# Altium project Shuttler_AMC.PrjPcb (part 19 of 20)
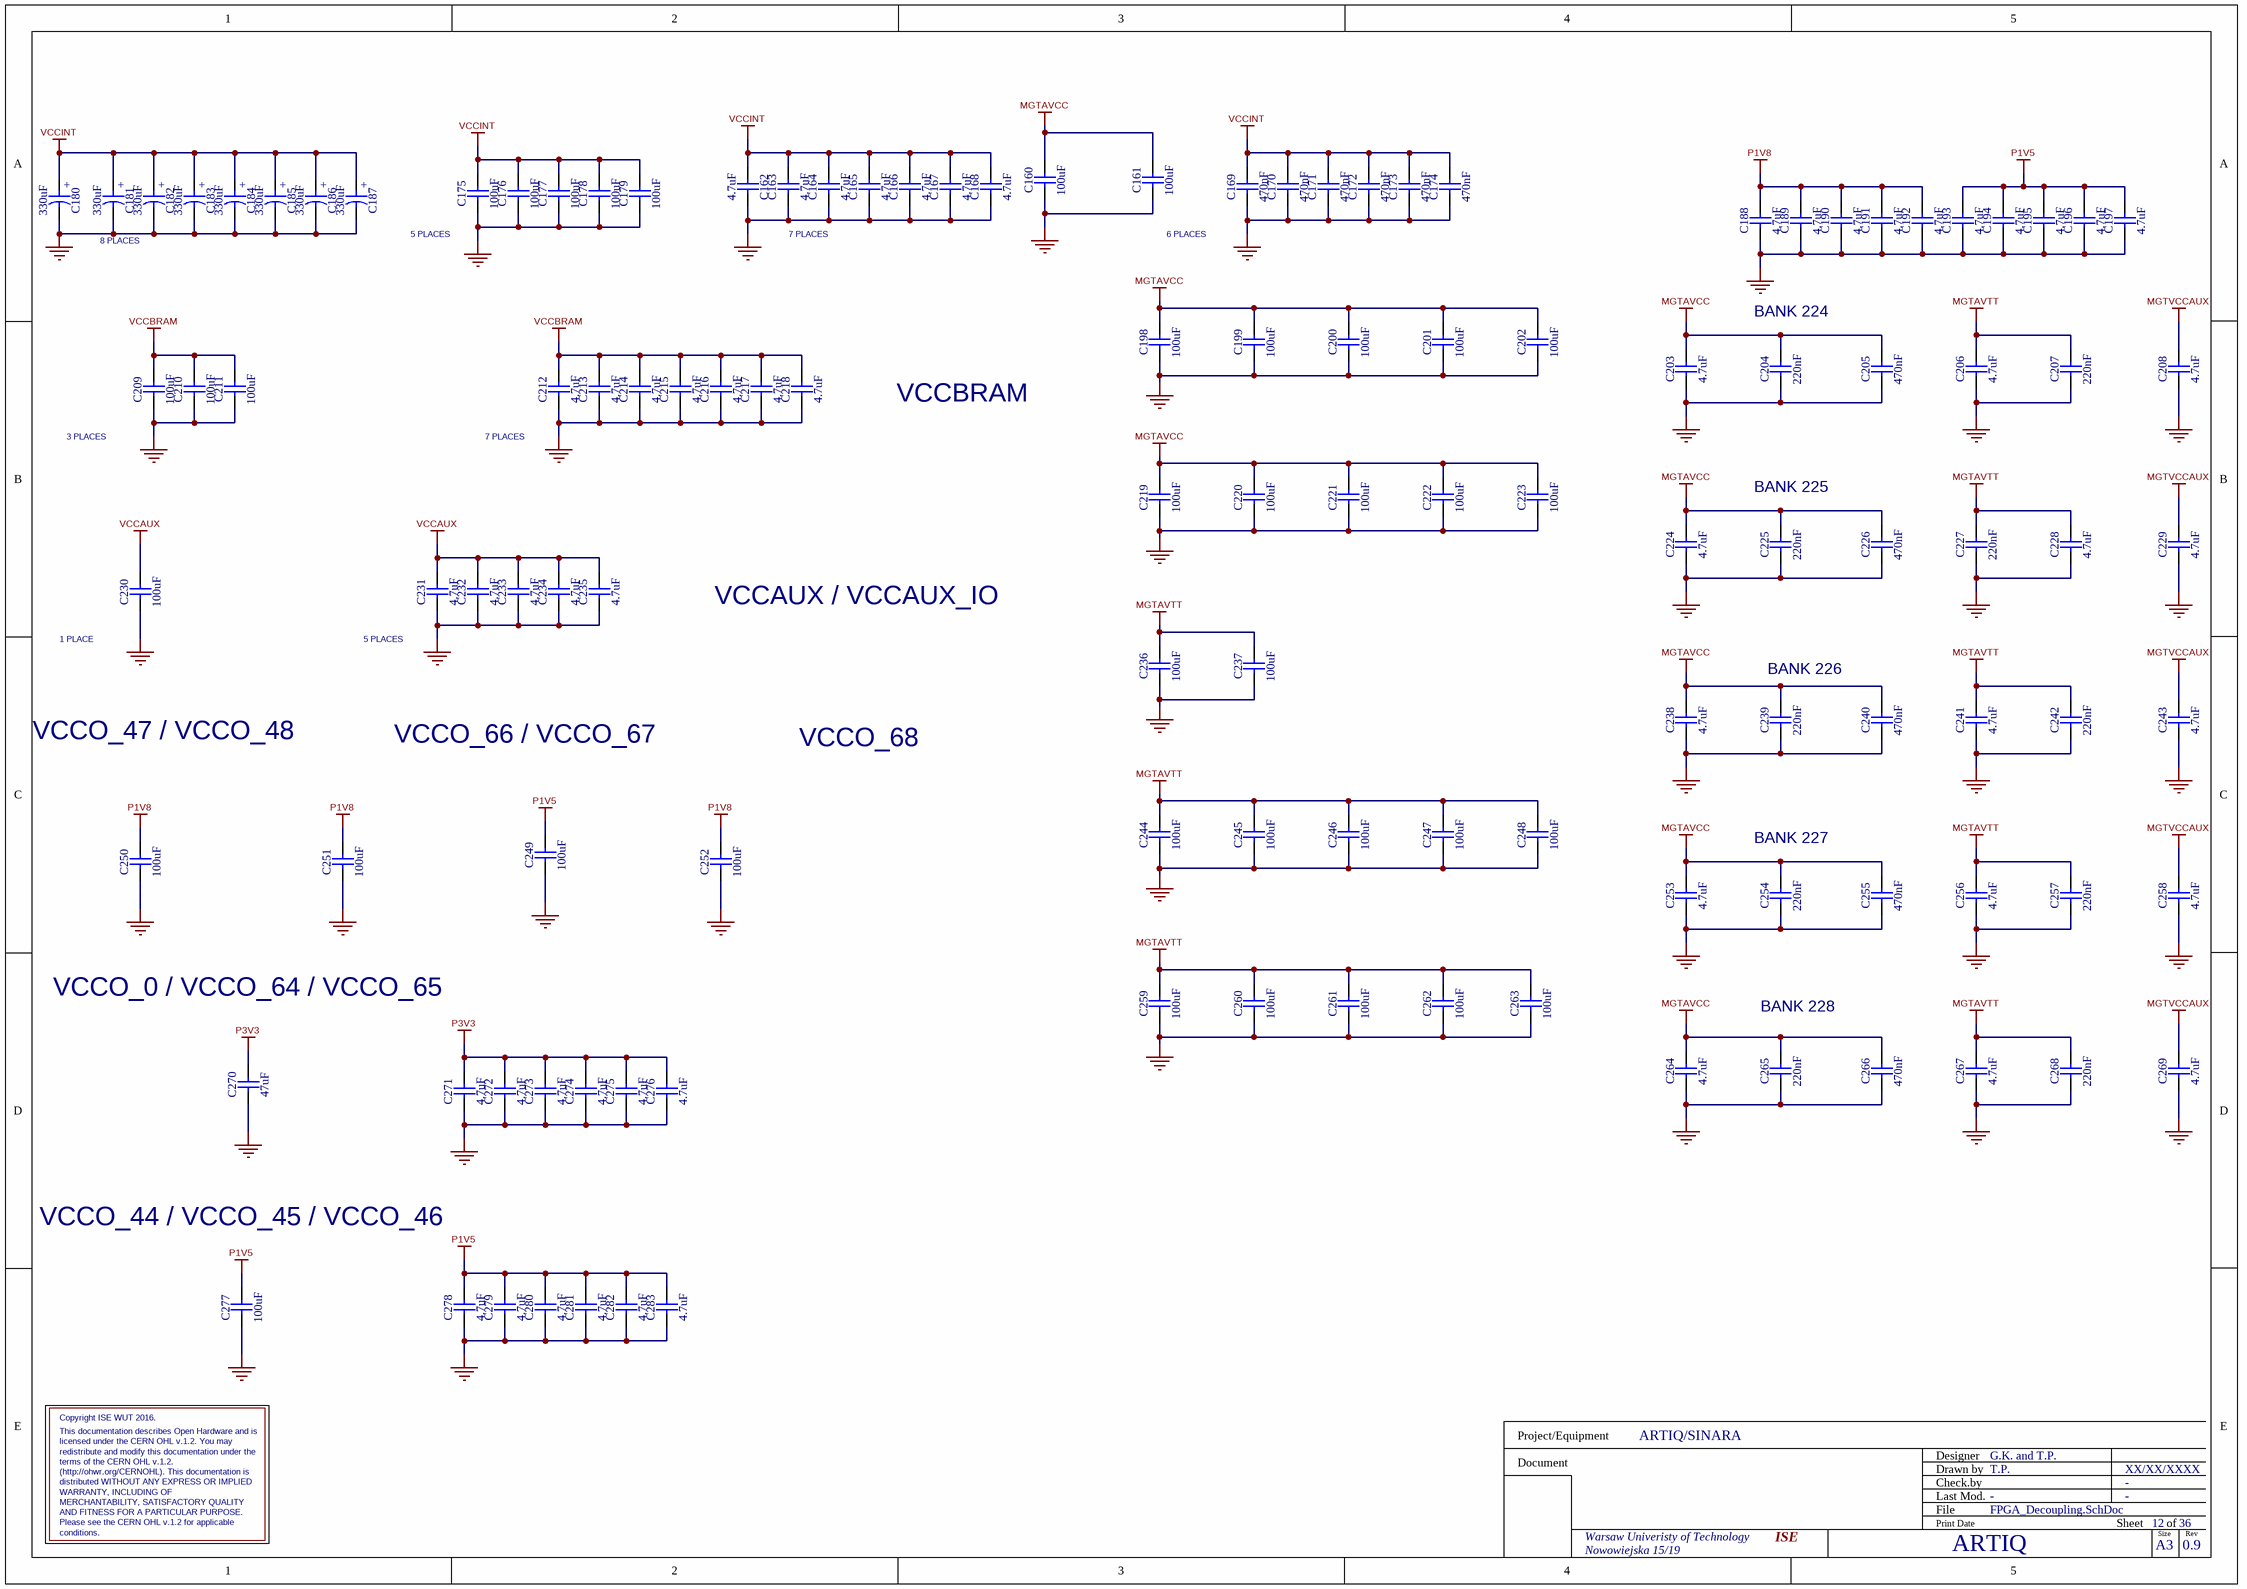
[diagram p37: FPGA_Decoupling.SchDoc]
## Nets that join several sheets
AVDD1V8: DACs/U_DAC_LTC2000 (5 pins), DACs/U_DAC_LTC2000 (5 pins), DACs/U_DAC_LTC2000 (5 pins), DACs/U_DAC_LTC2000 (5 pins), DACs/U_DAC_LTC2000 (5 pins), DACs/U_DAC_LTC2000 (5 pins), DACs/U_DAC_LTC2000 (5 pins), DACs/U_DAC_LTC2000 (5 pins), DACs/U_DAC_LTC2000 (5 pins), DACs/U_DAC_LTC2000 (5 pins), DACs/U_DAC_LTC2000 (5 pins), DACs/U_DAC_LTC2000 (5 pins), DACs/U_DAC_LTC2000 (5 pins), DACs/U_DAC_LTC2000 (5 pins), DACs/U_DAC_LTC2000 (5 pins), DACs/U_DAC_LTC2000 (5 pins), DACs/U_DAC_LTC2000 (5 pins), DACs/U_DAC_LTC2000 (5 pins)
AVDD18_A: DAC_supply (9 pins), DACs/U_DAC_LTC2000 (9 pins), DACs/U_DAC_LTC2000 (9 pins), DACs/U_DAC_LTC2000 (9 pins), DACs/U_DAC_LTC2000 (9 pins), DACs/U_DAC_LTC2000 (9 pins), DACs/U_DAC_LTC2000 (9 pins), DACs/U_DAC_LTC2000 (9 pins), DACs/U_DAC_LTC2000 (9 pins)
AVDD18_B: DAC_supply (9 pins), DACs/U_DAC_LTC2000 (9 pins), DACs/U_DAC_LTC2000 (9 pins), DACs/U_DAC_LTC2000 (9 pins), DACs/U_DAC_LTC2000 (9 pins), DACs/U_DAC_LTC2000 (9 pins), DACs/U_DAC_LTC2000 (9 pins), DACs/U_DAC_LTC2000 (9 pins), DACs/U_DAC_LTC2000 (9 pins), DACs/U_DAC_LTC2000 (9 pins), DACs/U_DAC_LTC2000 (9 pins)
AVDD33: DAC_supply (9 pins), DACs/U_DAC_LTC2000 (14 pins), DACs/U_DAC_LTC2000 (14 pins), DACs/U_DAC_LTC2000 (14 pins), DACs/U_DAC_LTC2000 (14 pins), DACs/U_DAC_LTC2000 (14 pins), DACs/U_DAC_LTC2000 (14 pins), DACs/U_DAC_LTC2000 (14 pins), DACs/U_DAC_LTC2000 (14 pins), DACs/U_DAC_LTC2000 (14 pins), DACs/U_DAC_LTC2000 (14 pins), DACs/U_DAC_LTC2000 (14 pins), DACs/U_DAC_LTC2000 (14 pins), DACs/U_DAC_LTC2000 (14 pins), DACs/U_DAC_LTC2000 (14 pins), DACs/U_DAC_LTC2000 (14 pins), DACs/U_DAC_LTC2000 (14 pins), DACs/U_DAC_LTC2000 (14 pins), DACs/U_DAC_LTC2000 (14 pins)
DDR3_64_VREF: SDRAM_DDR3_4x16 (18 pins), FPGA_Bank_0_CFG (6 pins)
DVDD18: DAC_supply (9 pins), DACs/U_DAC_LTC2000 (13 pins), DACs/U_DAC_LTC2000 (13 pins), DACs/U_DAC_LTC2000 (13 pins), DACs/U_DAC_LTC2000 (13 pins), DACs/U_DAC_LTC2000 (13 pins), DACs/U_DAC_LTC2000 (13 pins), DACs/U_DAC_LTC2000 (13 pins), DACs/U_DAC_LTC2000 (13 pins), DACs/U_DAC_LTC2000 (13 pins), DACs/U_DAC_LTC2000 (13 pins), DACs/U_DAC_LTC2000 (13 pins), DACs/U_DAC_LTC2000 (13 pins), DACs/U_DAC_LTC2000 (13 pins), DACs/U_DAC_LTC2000 (13 pins), DACs/U_DAC_LTC2000 (13 pins), DACs/U_DAC_LTC2000 (13 pins), DACs/U_DAC_LTC2000 (13 pins), DACs/U_DAC_LTC2000 (13 pins)
DVDD33: DAC_supply (7 pins), DACs/U_DAC_LTC2000 (7 pins), DACs/U_DAC_LTC2000 (7 pins), DACs/U_DAC_LTC2000 (7 pins), DACs/U_DAC_LTC2000 (7 pins), DACs/U_DAC_LTC2000 (7 pins), DACs/U_DAC_LTC2000 (7 pins), DACs/U_DAC_LTC2000 (7 pins), DACs/U_DAC_LTC2000 (7 pins), DACs/U_DAC_LTC2000 (7 pins), DACs/U_DAC_LTC2000 (7 pins), DACs/U_DAC_LTC2000 (7 pins), DACs/U_DAC_LTC2000 (7 pins), DACs/U_DAC_LTC2000 (7 pins), DACs/U_DAC_LTC2000 (7 pins), DACs/U_DAC_LTC2000 (7 pins), DACs/U_DAC_LTC2000 (7 pins), DACs/U_DAC_LTC2000 (7 pins), DACs/U_DAC_LTC2000 (7 pins)
GND: Shuttler_AMC (10 pins), USB_SERIAL_QUAD (48 pins), AMC_Connector (56 pins), SDRAM_DDR3_4x16 (177 pins), JTAG_Configuration (28 pins), POWER_Management (24 pins), PWR_0V9_20A (24 pins), clk_supply (35 pins), DAC_supply (52 pins), PWR_Buck_4V_20A (12 pins), PWR_Buck_P2V5_8A (13 pins), PWR_P3V0_N3V0 (41 pins), PWR_DC_DC_EXAR2 (47 pins), QUAD_BUCK (40 pins), Clk_recovery (73 pins), DDMTD (13 pins), I2C_MUX (7 pins), M-LVDS_PHY (38 pins), Thermometers (23 pins), CPU_LPC1776 (51 pins), QSFP (39 pins), DACs (15 pins), DACs/U_DAC_LTC2000 (110 pins), DACs/U_DAC_LTC2000/Amplifier (11 pins), DACs/U_DAC_LTC2000 (110 pins), DACs/U_DAC_LTC2000/Amplifier (11 pins), DACs/U_DAC_LTC2000 (110 pins), DACs/U_DAC_LTC2000/Amplifier (11 pins), DACs/U_DAC_LTC2000 (110 pins), DACs/U_DAC_LTC2000/Amplifier (11 pins), DACs/U_DAC_LTC2000 (110 pins), DACs/U_DAC_LTC2000/Amplifier (11 pins), DACs/U_DAC_LTC2000 (110 pins), DACs/U_DAC_LTC2000/Amplifier (11 pins), DACs/U_DAC_LTC2000 (110 pins), DACs/U_DAC_LTC2000/Amplifier (11 pins), DACs/U_DAC_LTC2000 (110 pins), DACs/U_DAC_LTC2000/Amplifier (11 pins), DACs/U_DAC_LTC2000 (110 pins), DACs/U_DAC_LTC2000/Amplifier (11 pins), DACs/U_DAC_LTC2000 (110 pins), DACs/U_DAC_LTC2000/Amplifier (11 pins), DACs/U_DAC_LTC2000 (110 pins), DACs/U_DAC_LTC2000/Amplifier (11 pins), DACs/U_DAC_LTC2000 (110 pins), DACs/U_DAC_LTC2000/Amplifier (11 pins), DACs/U_DAC_LTC2000 (110 pins), DACs/U_DAC_LTC2000/Amplifier (11 pins), DACs/U_DAC_LTC2000 (110 pins), DACs/U_DAC_LTC2000/Amplifier (11 pins), DACs/U_DAC_LTC2000 (110 pins), DACs/U_DAC_LTC2000/Amplifier (11 pins), DACs/U_DAC_LTC2000 (110 pins), DACs/U_DAC_LTC2000/Amplifier (11 pins), DACs/U_DAC_LTC2000 (110 pins), DACs/U_DAC_LTC2000/Amplifier (11 pins), DACs/U_DAC_LTC2000 (110 pins), DACs/U_DAC_LTC2000/Amplifier (11 pins), Clock_Distribution_PLL (87 pins), ETH_PHY_RMII (33 pins), QSFP (39 pins), IO_Connectors (36 pins), FPGA_Bank_0_CFG (26 pins), FPGA_Banks_GTH (23 pins), FPGA_Banks_44_45_46_DDR64 (7 pins), FPGA_Banks_64_65_HR (C608.2 R413.1), FPGA_Power (18 pins), FPGA_GND_NC (271 pins), FPGA_Decoupling (124 pins)
MGTAVCC: PWR_DC_DC_EXAR2 (L64.2 L65.2), FPGA_Power (14 pins), FPGA_Decoupling (27 pins)
MGTAVTT: PWR_DC_DC_EXAR2 (L34.2), FPGA_Bank_0_CFG (IC27.AP6 R380.2), FPGA_Power (16 pins), FPGA_Decoupling (22 pins)
MGTVCCAUX: PWR_DC_DC_EXAR2 (L69.1), FPGA_Power (IC27.AA6 IC27.R6), FPGA_Decoupling (5 pins)
N3VA: DACs/U_DAC_LTC2000/Amplifier (L1001_DACs_U_DAC_LTC2000_Amplifier#1.1 R1027_DACs_U_DAC_LTC2000_Amplifier#1.2), DACs/U_DAC_LTC2000/Amplifier (L1001_DACs_U_DAC_LTC2000_Amplifier#2.1 R1027_DACs_U_DAC_LTC2000_Amplifier#2.2), DACs/U_DAC_LTC2000/Amplifier (L1001_DACs_U_DAC_LTC2000_Amplifier#3.1 R1027_DACs_U_DAC_LTC2000_Amplifier#3.2), DACs/U_DAC_LTC2000/Amplifier (L1001_DACs_U_DAC_LTC2000_Amplifier#4.1 R1027_DACs_U_DAC_LTC2000_Amplifier#4.2), DACs/U_DAC_LTC2000/Amplifier (L1001_DACs_U_DAC_LTC2000_Amplifier#5.1 R1027_DACs_U_DAC_LTC2000_Amplifier#5.2), DACs/U_DAC_LTC2000/Amplifier (L1001_DACs_U_DAC_LTC2000_Amplifier#6.1 R1027_DACs_U_DAC_LTC2000_Amplifier#6.2), DACs/U_DAC_LTC2000/Amplifier (L1001_DACs_U_DAC_LTC2000_Amplifier#7.1 R1027_DACs_U_DAC_LTC2000_Amplifier#7.2), DACs/U_DAC_LTC2000/Amplifier (L1001_DACs_U_DAC_LTC2000_Amplifier#8.1 R1027_DACs_U_DAC_LTC2000_Amplifier#8.2), DACs/U_DAC_LTC2000/Amplifier (L1001_DACs_U_DAC_LTC2000_Amplifier#9.1 R1027_DACs_U_DAC_LTC2000_Amplifier#9.2), DACs/U_DAC_LTC2000/Amplifier (L1001_DACs_U_DAC_LTC2000_Amplifier#10.1 R1027_DACs_U_DAC_LTC2000_Amplifier#10.2), DACs/U_DAC_LTC2000/Amplifier (L1001_DACs_U_DAC_LTC2000_Amplifier#11.1 R1027_DACs_U_DAC_LTC2000_Amplifier#11.2), DACs/U_DAC_LTC2000/Amplifier (L1001_DACs_U_DAC_LTC2000_Amplifier#12.1 R1027_DACs_U_DAC_LTC2000_Amplifier#12.2), DACs/U_DAC_LTC2000/Amplifier (L1001_DACs_U_DAC_LTC2000_Amplifier#13.1 R1027_DACs_U_DAC_LTC2000_Amplifier#13.2), DACs/U_DAC_LTC2000/Amplifier (L1001_DACs_U_DAC_LTC2000_Amplifier#14.1 R1027_DACs_U_DAC_LTC2000_Amplifier#14.2), DACs/U_DAC_LTC2000/Amplifier (L1001_DACs_U_DAC_LTC2000_Amplifier#15.1 R1027_DACs_U_DAC_LTC2000_Amplifier#15.2), DACs/U_DAC_LTC2000/Amplifier (L1001_DACs_U_DAC_LTC2000_Amplifier#16.1 R1027_DACs_U_DAC_LTC2000_Amplifier#16.2), DACs/U_DAC_LTC2000/Amplifier (L1001_DACs_U_DAC_LTC2000_Amplifier#17.1 R1027_DACs_U_DAC_LTC2000_Amplifier#17.2), DACs/U_DAC_LTC2000/Amplifier (L1001_DACs_U_DAC_LTC2000_Amplifier#18.1 R1027_DACs_U_DAC_LTC2000_Amplifier#18.2)
P1V5: SDRAM_DDR3_4x16 (131 pins), PWR_DC_DC_EXAR2 (5 pins), M-LVDS_PHY (6 pins), FPGA_Banks_44_45_46_DDR64 (R118.1 R119.1 R172.1 R208.1), FPGA_Power (20 pins), FPGA_Decoupling (13 pins)
P1V8: DAC_supply (C154.1 IC21.2 R103.1), PWR_DC_DC_EXAR2 (6 pins), FPGA_Power (40 pins), FPGA_Decoupling (8 pins)
P1V25_REF: DAC_supply (C127.1 IC15.6 IC15.7), DACs/U_DAC_LTC2000 (C1002_DACs_U_DAC_LTC2000#1.2 IC1000_DACs_U_DAC_LTC2000#1.M1), DACs/U_DAC_LTC2000 (C1002_DACs_U_DAC_LTC2000#2.2 IC1000_DACs_U_DAC_LTC2000#2.M1), DACs/U_DAC_LTC2000 (C1002_DACs_U_DAC_LTC2000#3.2 IC1000_DACs_U_DAC_LTC2000#3.M1), DACs/U_DAC_LTC2000 (C1002_DACs_U_DAC_LTC2000#4.2 IC1000_DACs_U_DAC_LTC2000#4.M1), DACs/U_DAC_LTC2000 (C1002_DACs_U_DAC_LTC2000#5.2 IC1000_DACs_U_DAC_LTC2000#5.M1), DACs/U_DAC_LTC2000 (C1002_DACs_U_DAC_LTC2000#6.2 IC1000_DACs_U_DAC_LTC2000#6.M1), DACs/U_DAC_LTC2000 (C1002_DACs_U_DAC_LTC2000#7.2 IC1000_DACs_U_DAC_LTC2000#7.M1), DACs/U_DAC_LTC2000 (C1002_DACs_U_DAC_LTC2000#8.2 IC1000_DACs_U_DAC_LTC2000#8.M1), DACs/U_DAC_LTC2000 (C1002_DACs_U_DAC_LTC2000#9.2 IC1000_DACs_U_DAC_LTC2000#9.M1), DACs/U_DAC_LTC2000 (C1002_DACs_U_DAC_LTC2000#10.2 IC1000_DACs_U_DAC_LTC2000#10.M1), DACs/U_DAC_LTC2000 (C1002_DACs_U_DAC_LTC2000#11.2 IC1000_DACs_U_DAC_LTC2000#11.M1), DACs/U_DAC_LTC2000 (C1002_DACs_U_DAC_LTC2000#12.2 IC1000_DACs_U_DAC_LTC2000#12.M1), DACs/U_DAC_LTC2000 (C1002_DACs_U_DAC_LTC2000#13.2 IC1000_DACs_U_DAC_LTC2000#13.M1), DACs/U_DAC_LTC2000 (C1002_DACs_U_DAC_LTC2000#14.2 IC1000_DACs_U_DAC_LTC2000#14.M1), DACs/U_DAC_LTC2000 (C1002_DACs_U_DAC_LTC2000#15.2 IC1000_DACs_U_DAC_LTC2000#15.M1), DACs/U_DAC_LTC2000 (C1002_DACs_U_DAC_LTC2000#16.2 IC1000_DACs_U_DAC_LTC2000#16.M1), DACs/U_DAC_LTC2000 (C1002_DACs_U_DAC_LTC2000#17.2 IC1000_DACs_U_DAC_LTC2000#17.M1), DACs/U_DAC_LTC2000 (C1002_DACs_U_DAC_LTC2000#18.2 IC1000_DACs_U_DAC_LTC2000#18.M1)
P2V5_CLK1: clk_supply (C11.2 IC4.9 IC4.10), Clock_Distribution_PLL (L10.2)
P2V5_CLK2: clk_supply (C14.2 IC5.9 IC5.10), Clock_Distribution_PLL (L11.2)
P3V3: USB_SERIAL_QUAD (C553.2 C557.2 IC63.8 IC64.1), SDRAM_DDR3_4x16 (C416.1 IC50.7 IC50.10), JTAG_Configuration (13 pins), clk_supply (L4.1 L5.1), DAC_supply (27 pins), PWR_DC_DC_EXAR2 (L49.2 L61.2 R95.2 TP47.1), Clk_recovery (R321.2 R386.2), I2C_MUX (9 pins), M-LVDS_PHY (34 pins), QSFP (18 pins), DACs (15 pins), DACs/U_DAC_LTC2000 (C1008_DACs_U_DAC_LTC2000#1.2 IC1000_DACs_U_DAC_LTC2000#1.S6), DACs/U_DAC_LTC2000 (C1008_DACs_U_DAC_LTC2000#2.2 IC1000_DACs_U_DAC_LTC2000#2.S6), DACs/U_DAC_LTC2000 (C1008_DACs_U_DAC_LTC2000#3.2 IC1000_DACs_U_DAC_LTC2000#3.S6), DACs/U_DAC_LTC2000 (C1008_DACs_U_DAC_LTC2000#4.2 IC1000_DACs_U_DAC_LTC2000#4.S6), DACs/U_DAC_LTC2000 (C1008_DACs_U_DAC_LTC2000#5.2 IC1000_DACs_U_DAC_LTC2000#5.S6), DACs/U_DAC_LTC2000 (C1008_DACs_U_DAC_LTC2000#6.2 IC1000_DACs_U_DAC_LTC2000#6.S6), DACs/U_DAC_LTC2000 (C1008_DACs_U_DAC_LTC2000#7.2 IC1000_DACs_U_DAC_LTC2000#7.S6), DACs/U_DAC_LTC2000 (C1008_DACs_U_DAC_LTC2000#8.2 IC1000_DACs_U_DAC_LTC2000#8.S6), DACs/U_DAC_LTC2000 (C1008_DACs_U_DAC_LTC2000#9.2 IC1000_DACs_U_DAC_LTC2000#9.S6), DACs/U_DAC_LTC2000 (C1008_DACs_U_DAC_LTC2000#10.2 IC1000_DACs_U_DAC_LTC2000#10.S6), DACs/U_DAC_LTC2000 (C1008_DACs_U_DAC_LTC2000#11.2 IC1000_DACs_U_DAC_LTC2000#11.S6), DACs/U_DAC_LTC2000 (C1008_DACs_U_DAC_LTC2000#12.2 IC1000_DACs_U_DAC_LTC2000#12.S6), DACs/U_DAC_LTC2000 (C1008_DACs_U_DAC_LTC2000#13.2 IC1000_DACs_U_DAC_LTC2000#13.S6), DACs/U_DAC_LTC2000 (C1008_DACs_U_DAC_LTC2000#14.2 IC1000_DACs_U_DAC_LTC2000#14.S6), DACs/U_DAC_LTC2000 (C1008_DACs_U_DAC_LTC2000#15.2 IC1000_DACs_U_DAC_LTC2000#15.S6), DACs/U_DAC_LTC2000 (C1008_DACs_U_DAC_LTC2000#16.2 IC1000_DACs_U_DAC_LTC2000#16.S6), DACs/U_DAC_LTC2000 (C1008_DACs_U_DAC_LTC2000#17.2 IC1000_DACs_U_DAC_LTC2000#17.S6), DACs/U_DAC_LTC2000 (C1008_DACs_U_DAC_LTC2000#18.2 IC1000_DACs_U_DAC_LTC2000#18.S6), ETH_PHY_RMII (9 pins), QSFP (18 pins), FPGA_Bank_0_CFG (21 pins), FPGA_Banks_GTH (L45.2 L46.2), FPGA_Banks_64_65_HR (R412.2), FPGA_Power (9 pins), FPGA_Decoupling (7 pins)
P3V3_CDR: Clk_recovery (8 pins), DDMTD (L63.1)
P3V3_CLK: clk_supply (C5.2 IC2.9 IC2.10), Clock_Distribution_PLL (15 pins)
P3V3_CLKDIS1: clk_supply (C8.2 IC3.9 IC3.10), Clock_Distribution_PLL (L6.2 L9.2)
P3V3_USB: USB_SERIAL_QUAD (34 pins), JTAG_Configuration (11 pins)
P3V3MP: Shuttler_AMC (5 pins), USB_SERIAL_QUAD (IC71.1 R348.1 R349.2), AMC_Connector (J1.4), JTAG_Configuration (5 pins), POWER_Management (8 pins), PWR_0V9_20A (R210.2), PWR_Buck_4V_20A (R435.2), PWR_Buck_P2V5_8A (R448.2), PWR_P3V0_N3V0 (R464.2), PWR_DC_DC_EXAR2 (6 pins), QUAD_BUCK (R424.2), I2C_MUX (17 pins), Thermometers (20 pins), CPU_LPC1776 (52 pins), FPGA_Bank_0_CFG (C607.2 IC70.14)
P3VA: DACs/U_DAC_LTC2000/Amplifier (L1000_DACs_U_DAC_LTC2000_Amplifier#1.2 R1026_DACs_U_DAC_LTC2000_Amplifier#1.1 T1000_DACs_U_DAC_LTC2000_Amplifier#1.2), DACs/U_DAC_LTC2000/Amplifier (L1000_DACs_U_DAC_LTC2000_Amplifier#2.2 R1026_DACs_U_DAC_LTC2000_Amplifier#2.1 T1000_DACs_U_DAC_LTC2000_Amplifier#2.2), DACs/U_DAC_LTC2000/Amplifier (L1000_DACs_U_DAC_LTC2000_Amplifier#3.2 R1026_DACs_U_DAC_LTC2000_Amplifier#3.1 T1000_DACs_U_DAC_LTC2000_Amplifier#3.2), DACs/U_DAC_LTC2000/Amplifier (L1000_DACs_U_DAC_LTC2000_Amplifier#4.2 R1026_DACs_U_DAC_LTC2000_Amplifier#4.1 T1000_DACs_U_DAC_LTC2000_Amplifier#4.2), DACs/U_DAC_LTC2000/Amplifier (L1000_DACs_U_DAC_LTC2000_Amplifier#5.2 R1026_DACs_U_DAC_LTC2000_Amplifier#5.1 T1000_DACs_U_DAC_LTC2000_Amplifier#5.2), DACs/U_DAC_LTC2000/Amplifier (L1000_DACs_U_DAC_LTC2000_Amplifier#6.2 R1026_DACs_U_DAC_LTC2000_Amplifier#6.1 T1000_DACs_U_DAC_LTC2000_Amplifier#6.2), DACs/U_DAC_LTC2000/Amplifier (L1000_DACs_U_DAC_LTC2000_Amplifier#7.2 R1026_DACs_U_DAC_LTC2000_Amplifier#7.1 T1000_DACs_U_DAC_LTC2000_Amplifier#7.2), DACs/U_DAC_LTC2000/Amplifier (L1000_DACs_U_DAC_LTC2000_Amplifier#8.2 R1026_DACs_U_DAC_LTC2000_Amplifier#8.1 T1000_DACs_U_DAC_LTC2000_Amplifier#8.2), DACs/U_DAC_LTC2000/Amplifier (L1000_DACs_U_DAC_LTC2000_Amplifier#9.2 R1026_DACs_U_DAC_LTC2000_Amplifier#9.1 T1000_DACs_U_DAC_LTC2000_Amplifier#9.2), DACs/U_DAC_LTC2000/Amplifier (L1000_DACs_U_DAC_LTC2000_Amplifier#10.2 R1026_DACs_U_DAC_LTC2000_Amplifier#10.1 T1000_DACs_U_DAC_LTC2000_Amplifier#10.2), DACs/U_DAC_LTC2000/Amplifier (L1000_DACs_U_DAC_LTC2000_Amplifier#11.2 R1026_DACs_U_DAC_LTC2000_Amplifier#11.1 T1000_DACs_U_DAC_LTC2000_Amplifier#11.2), DACs/U_DAC_LTC2000/Amplifier (L1000_DACs_U_DAC_LTC2000_Amplifier#12.2 R1026_DACs_U_DAC_LTC2000_Amplifier#12.1 T1000_DACs_U_DAC_LTC2000_Amplifier#12.2), DACs/U_DAC_LTC2000/Amplifier (L1000_DACs_U_DAC_LTC2000_Amplifier#13.2 R1026_DACs_U_DAC_LTC2000_Amplifier#13.1 T1000_DACs_U_DAC_LTC2000_Amplifier#13.2), DACs/U_DAC_LTC2000/Amplifier (L1000_DACs_U_DAC_LTC2000_Amplifier#14.2 R1026_DACs_U_DAC_LTC2000_Amplifier#14.1 T1000_DACs_U_DAC_LTC2000_Amplifier#14.2), DACs/U_DAC_LTC2000/Amplifier (L1000_DACs_U_DAC_LTC2000_Amplifier#15.2 R1026_DACs_U_DAC_LTC2000_Amplifier#15.1 T1000_DACs_U_DAC_LTC2000_Amplifier#15.2), DACs/U_DAC_LTC2000/Amplifier (L1000_DACs_U_DAC_LTC2000_Amplifier#16.2 R1026_DACs_U_DAC_LTC2000_Amplifier#16.1 T1000_DACs_U_DAC_LTC2000_Amplifier#16.2), DACs/U_DAC_LTC2000/Amplifier (L1000_DACs_U_DAC_LTC2000_Amplifier#17.2 R1026_DACs_U_DAC_LTC2000_Amplifier#17.1 T1000_DACs_U_DAC_LTC2000_Amplifier#17.2), DACs/U_DAC_LTC2000/Amplifier (L1000_DACs_U_DAC_LTC2000_Amplifier#18.2 R1026_DACs_U_DAC_LTC2000_Amplifier#18.1 T1000_DACs_U_DAC_LTC2000_Amplifier#18.2)
P4V0: clk_supply (L2.1 L3.1), PWR_Buck_4V_20A (6 pins), PWR_P3V0_N3V0 (L56.1), Clk_recovery (L38.1)
P5V0: DAC_supply (22 pins), PWR_DC_DC_EXAR2 (6 pins), QUAD_BUCK (R423.2)
P5V0_CLK: clk_supply (C2.2 IC1.9 IC1.10), Clock_Distribution_PLL (L7.2 L8.2)
P6V0: clk_supply (L1.1), PWR_DC_DC_EXAR2 (C117.2 L73.2)
P12V0: POWER_Management (12 pins), PWR_0V9_20A (15 pins), PWR_Buck_4V_20A (9 pins), PWR_Buck_P2V5_8A (9 pins), PWR_P3V0_N3V0 (5 pins), PWR_DC_DC_EXAR2 (8 pins), QUAD_BUCK (10 pins)
PAYLOAD_PWR: AMC_Connector (8 pins), POWER_Management (5 pins)
VCCAUX: PWR_DC_DC_EXAR2 (L67.2), FPGA_Power (15 pins), FPGA_Decoupling (6 pins)
VCCBRAM: PWR_DC_DC_EXAR2 (L48.2 R76.2), FPGA_Power (IC27.AA18 IC27.AB17 IC27.V17 IC27.Y17), FPGA_Decoupling (10 pins)
VCCINT: PWR_0V9_20A (R200.2 R201.2 R207.2), PWR_DC_DC_EXAR2 (R76.1 TP49.1), FPGA_Power (49 pins), FPGA_Decoupling (26 pins)
VTT64: SDRAM_DDR3_4x16 (43 pins), FPGA_Banks_44_45_46_DDR64 (6 pins)
VTT_DAC: DAC_supply (C152.2 C153.2 IC21.3 R104.2), DACs/U_DAC_LTC2000 (34 pins), DACs/U_DAC_LTC2000 (34 pins), DACs/U_DAC_LTC2000 (34 pins), DACs/U_DAC_LTC2000 (34 pins), DACs/U_DAC_LTC2000 (34 pins), DACs/U_DAC_LTC2000 (34 pins), DACs/U_DAC_LTC2000 (34 pins), DACs/U_DAC_LTC2000 (34 pins), DACs/U_DAC_LTC2000 (34 pins), DACs/U_DAC_LTC2000 (34 pins), DACs/U_DAC_LTC2000 (34 pins), DACs/U_DAC_LTC2000 (34 pins), DACs/U_DAC_LTC2000 (34 pins), DACs/U_DAC_LTC2000 (34 pins), DACs/U_DAC_LTC2000 (34 pins), DACs/U_DAC_LTC2000 (34 pins), DACs/U_DAC_LTC2000 (34 pins), DACs/U_DAC_LTC2000 (34 pins)
AFE_CTRL_0: IO_Connectors (J28.A8), FPGA_Banks_44_45_46_DDR64 (IC27.AF25)
AFE_CTRL_1: IO_Connectors (J28.A9), FPGA_Banks_44_45_46_DDR64 (IC27.AE26)
AFE_CTRL_2: IO_Connectors (J28.A10), FPGA_Banks_44_45_46_DDR64 (IC27.AD14)
AFE_CTRL_3: IO_Connectors (J28.A11), FPGA_Banks_44_45_46_DDR64 (IC27.AG15)
AFE_CTRL_4: IO_Connectors (J28.B8), FPGA_Banks_44_45_46_DDR64 (IC27.AK33)
AFE_CTRL_5: IO_Connectors (J28.B9), FPGA_Banks_44_45_46_DDR64 (IC27.AL33)
AFE_CTRL_6: IO_Connectors (J28.B10), FPGA_Banks_44_45_46_DDR64 (IC27.AH29)
AFE_CTRL_7: IO_Connectors (J28.B11), FPGA_Banks_44_45_46_DDR64 (IC27.AK30)
AFE_CTRL_8: IO_Connectors (J29.A8), FPGA_Banks_44_45_46_DDR64 (IC27.AM31)
AFE_CTRL_9: IO_Connectors (J29.A9), FPGA_Banks_44_45_46_DDR64 (IC27.AP26)
ALT_PORT0.Rx0_N: ETH_PHY_RMII (C726.2), FPGA_Banks_GTH (IC27.AJ3)
ALT_PORT0.Rx0_P: ETH_PHY_RMII (C725.2), FPGA_Banks_GTH (IC27.AJ4)
ALT_PORT0.Tx0_N: ETH_PHY_RMII (C728.2), FPGA_Banks_GTH (IC27.AK5)
ALT_PORT0.Tx0_P: ETH_PHY_RMII (C727.2), FPGA_Banks_GTH (IC27.AK6)
AMC_ADD.GA0: AMC_Connector (J1.5), CPU_LPC1776 (D4.1 R47.1 R50.1)
AMC_ADD.GA1: AMC_Connector (J1.17), CPU_LPC1776 (D6.1 R48.1 R51.1)
AMC_ADD.GA2: AMC_Connector (J1.26), CPU_LPC1776 (D5.1 R49.1 R53.1)
AMC_En: AMC_Connector (J1.41), CPU_LPC1776 (5 pins)
AMC_FABRIC_CLOCK.FCLKA_N: AMC_Connector (J1.81), FPGA_Banks_GTH (C713.2)
AMC_FABRIC_CLOCK.FCLKA_P: AMC_Connector (J1.80), FPGA_Banks_GTH (C714.2)
AMC_JTAG.TCK_PROG: AMC_Connector (J1.165), JTAG_Configuration (D12.1 IC30.9 R152.1)
AMC_JTAG.TDI_PROG: AMC_Connector (J1.169), JTAG_Configuration (D10.1 IC30.4 R150.1)
AMC_JTAG.TDO_PROG: AMC_Connector (J1.168), JTAG_Configuration (D11.1 IC30.7 R151.1)
AMC_JTAG.TMS_PROG: AMC_Connector (J1.166), JTAG_Configuration (D13.1 IC30.12 R153.1)
AMC_JTAG.TRSTn_PROG: AMC_Connector (J1.167), JTAG_Configuration (D15.1 R159.2)
AMC_P2P.Rx12_N: AMC_Connector (J1.112), FPGA_Banks_GTH (IC27.AB2)
AMC_P2P.Rx12_P: AMC_Connector (J1.111), FPGA_Banks_GTH (IC27.AB1)
AMC_P2P.Rx13_N: AMC_Connector (J1.118), FPGA_Banks_GTH (IC27.AD2)
AMC_P2P.Rx13_P: AMC_Connector (J1.117), FPGA_Banks_GTH (IC27.AD1)
AMC_P2P.Rx14_N: AMC_Connector (J1.124), FPGA_Banks_GTH (IC27.AF2)
AMC_P2P.Rx14_P: AMC_Connector (J1.123), FPGA_Banks_GTH (IC27.AF1)
AMC_P2P.Rx15_N: AMC_Connector (J1.130), FPGA_Banks_GTH (IC27.AH2)
AMC_P2P.Rx15_P: AMC_Connector (J1.129), FPGA_Banks_GTH (IC27.AH1)
AMC_P2P.Tx12_N: AMC_Connector (J1.114), FPGA_Banks_GTH (C628.1)
AMC_P2P.Tx12_P: AMC_Connector (J1.115), FPGA_Banks_GTH (C630.1)
AMC_P2P.Tx13_N: AMC_Connector (J1.120), FPGA_Banks_GTH (C624.1)
AMC_P2P.Tx13_P: AMC_Connector (J1.121), FPGA_Banks_GTH (C625.1)
AMC_P2P.Tx14_N: AMC_Connector (J1.126), FPGA_Banks_GTH (C617.1)
AMC_P2P.Tx14_P: AMC_Connector (J1.127), FPGA_Banks_GTH (C618.1)
AMC_P2P.Tx15_N: AMC_Connector (J1.132), FPGA_Banks_GTH (C613.1)
AMC_P2P.Tx15_P: AMC_Connector (J1.133), FPGA_Banks_GTH (C614.1)
AOUT_N0: DACs/U_DAC_LTC2000/Amplifier (IC1001_DACs_U_DAC_LTC2000_Amplifier#13.11), IO_Connectors (J28.A3)
AOUT_N1: DACs/U_DAC_LTC2000/Amplifier (IC1001_DACs_U_DAC_LTC2000_Amplifier#14.11), IO_Connectors (J28.A6)
AOUT_N2: DACs/U_DAC_LTC2000/Amplifier (IC1001_DACs_U_DAC_LTC2000_Amplifier#15.11), IO_Connectors (J28.A14)
AOUT_N3: DACs/U_DAC_LTC2000/Amplifier (IC1001_DACs_U_DAC_LTC2000_Amplifier#16.11), IO_Connectors (J28.B3)
AOUT_N4: DACs/U_DAC_LTC2000/Amplifier (IC1001_DACs_U_DAC_LTC2000_Amplifier#17.11), IO_Connectors (J28.B6)
AOUT_N5: DACs/U_DAC_LTC2000/Amplifier (IC1001_DACs_U_DAC_LTC2000_Amplifier#18.11), IO_Connectors (J28.B14)
AOUT_N6: DACs/U_DAC_LTC2000/Amplifier (IC1001_DACs_U_DAC_LTC2000_Amplifier#7.11), IO_Connectors (J29.A6)
AOUT_N7: DACs/U_DAC_LTC2000/Amplifier (IC1001_DACs_U_DAC_LTC2000_Amplifier#8.11), IO_Connectors (J29.A3)
AOUT_N8: DACs/U_DAC_LTC2000/Amplifier (IC1001_DACs_U_DAC_LTC2000_Amplifier#9.11), IO_Connectors (J29.A14)
AOUT_N9: DACs/U_DAC_LTC2000/Amplifier (IC1001_DACs_U_DAC_LTC2000_Amplifier#10.11), IO_Connectors (J29.B3)
AOUT_N10: DACs/U_DAC_LTC2000/Amplifier (IC1001_DACs_U_DAC_LTC2000_Amplifier#11.11), IO_Connectors (J29.B6)
AOUT_N11: DACs/U_DAC_LTC2000/Amplifier (IC1001_DACs_U_DAC_LTC2000_Amplifier#12.11), IO_Connectors (J29.B14)
AOUT_N12: DACs/U_DAC_LTC2000/Amplifier (IC1001_DACs_U_DAC_LTC2000_Amplifier#1.11), IO_Connectors (J30.A3)
AOUT_N13: DACs/U_DAC_LTC2000/Amplifier (IC1001_DACs_U_DAC_LTC2000_Amplifier#2.11), IO_Connectors (J30.A6)
AOUT_N14: DACs/U_DAC_LTC2000/Amplifier (IC1001_DACs_U_DAC_LTC2000_Amplifier#3.11), IO_Connectors (J30.A14)
AOUT_N15: DACs/U_DAC_LTC2000/Amplifier (IC1001_DACs_U_DAC_LTC2000_Amplifier#4.11), IO_Connectors (J30.B3)
AOUT_N16: DACs/U_DAC_LTC2000/Amplifier (IC1001_DACs_U_DAC_LTC2000_Amplifier#5.11), IO_Connectors (J30.B6)
AOUT_N17: DACs/U_DAC_LTC2000/Amplifier (IC1001_DACs_U_DAC_LTC2000_Amplifier#6.11), IO_Connectors (J30.B14)
AOUT_P0: DACs/U_DAC_LTC2000/Amplifier (IC1001_DACs_U_DAC_LTC2000_Amplifier#13.10), IO_Connectors (J28.A2)
AOUT_P1: DACs/U_DAC_LTC2000/Amplifier (IC1001_DACs_U_DAC_LTC2000_Amplifier#14.10), IO_Connectors (J28.A5)
AOUT_P2: DACs/U_DAC_LTC2000/Amplifier (IC1001_DACs_U_DAC_LTC2000_Amplifier#15.10), IO_Connectors (J28.A13)
AOUT_P3: DACs/U_DAC_LTC2000/Amplifier (IC1001_DACs_U_DAC_LTC2000_Amplifier#16.10), IO_Connectors (J28.B2)
AOUT_P4: DACs/U_DAC_LTC2000/Amplifier (IC1001_DACs_U_DAC_LTC2000_Amplifier#17.10), IO_Connectors (J28.B5)
AOUT_P5: DACs/U_DAC_LTC2000/Amplifier (IC1001_DACs_U_DAC_LTC2000_Amplifier#18.10), IO_Connectors (J28.B13)
AOUT_P6: DACs/U_DAC_LTC2000/Amplifier (IC1001_DACs_U_DAC_LTC2000_Amplifier#7.10), IO_Connectors (J29.A5)
AOUT_P7: DACs/U_DAC_LTC2000/Amplifier (IC1001_DACs_U_DAC_LTC2000_Amplifier#8.10), IO_Connectors (J29.A2)
AOUT_P8: DACs/U_DAC_LTC2000/Amplifier (IC1001_DACs_U_DAC_LTC2000_Amplifier#9.10), IO_Connectors (J29.A13)
AOUT_P9: DACs/U_DAC_LTC2000/Amplifier (IC1001_DACs_U_DAC_LTC2000_Amplifier#10.10), IO_Connectors (J29.B2)
AOUT_P10: DACs/U_DAC_LTC2000/Amplifier (IC1001_DACs_U_DAC_LTC2000_Amplifier#11.10), IO_Connectors (J29.B5)
AOUT_P11: DACs/U_DAC_LTC2000/Amplifier (IC1001_DACs_U_DAC_LTC2000_Amplifier#12.10), IO_Connectors (J29.B13)
AOUT_P12: DACs/U_DAC_LTC2000/Amplifier (IC1001_DACs_U_DAC_LTC2000_Amplifier#1.10), IO_Connectors (J30.A2)
AOUT_P13: DACs/U_DAC_LTC2000/Amplifier (IC1001_DACs_U_DAC_LTC2000_Amplifier#2.10), IO_Connectors (J30.A5)
AOUT_P14: DACs/U_DAC_LTC2000/Amplifier (IC1001_DACs_U_DAC_LTC2000_Amplifier#3.10), IO_Connectors (J30.A13)
AOUT_P15: DACs/U_DAC_LTC2000/Amplifier (IC1001_DACs_U_DAC_LTC2000_Amplifier#4.10), IO_Connectors (J30.B2)
AOUT_P16: DACs/U_DAC_LTC2000/Amplifier (IC1001_DACs_U_DAC_LTC2000_Amplifier#5.10), IO_Connectors (J30.B5)
AOUT_P17: DACs/U_DAC_LTC2000/Amplifier (IC1001_DACs_U_DAC_LTC2000_Amplifier#6.10), IO_Connectors (J30.B13)
BOOT_MODE0: CPU_LPC1776 (IC11.P9), FPGA_Bank_0_CFG (R393.2)
BOOT_MODE1: CPU_LPC1776 (IC11.P11), FPGA_Bank_0_CFG (R390.2)
BOOT_MODE2: CPU_LPC1776 (IC11.P3), FPGA_Bank_0_CFG (R387.2)
BOOT_MODE3: CPU_LPC1776 (IC11.N5), FPGA_Bank_0_CFG (R384.2)
CDR_CLK_CLEAN1.CLK_N: Clk_recovery (C484.1), FPGA_Banks_GTH (IC27.P5)
CDR_CLK_CLEAN1.CLK_P: Clk_recovery (C483.1), FPGA_Banks_GTH (IC27.P6)
CDR_CLK_CLEAN1_N: Clk_recovery (C493.1), FPGA_Banks_GTH (IC27.AF5)
CDR_CLK_CLEAN1_P: Clk_recovery (C492.1), FPGA_Banks_GTH (IC27.AF6)
CDR_CLK_CLEAN2_N: Clk_recovery (C500.1), FPGA_Banks_GTH (IC27.Y5)
CDR_CLK_CLEAN2_P: Clk_recovery (C499.1), FPGA_Banks_GTH (IC27.Y6)
CDR_CLK_CLEAN3_N: Clk_recovery (C502.1), FPGA_Banks_64_65_HR (IC27.M26 R410.2 R411.1)
CDR_CLK_CLEAN3_P: Clk_recovery (C501.1), FPGA_Banks_64_65_HR (IC27.M25 R409.2 R411.2)
CDR_CLK_CLEAN4_N: Clk_recovery (C511.1), Clock_Distribution_PLL (IC7.2)
CDR_CLK_CLEAN4_P: Clk_recovery (C510.1), Clock_Distribution_PLL (IC7.1)
CLK_IN_FPGA.CLK_N: Clock_Distribution_PLL (C25.2), FPGA_Banks_64_65_HR (IC27.M24 R408.2)
CLK_IN_FPGA.CLK_P: Clock_Distribution_PLL (C24.2), FPGA_Banks_64_65_HR (IC27.N24 R407.2)
CLK_SEL: Clk_recovery (IC45.32), FPGA_Banks_64_65_HR (IC27.T25)
CS_0: DACs (IC22.1), DACs/U_DAC_LTC2000 (IC1000_DACs_U_DAC_LTC2000#13.S2)
CS_1: DACs (IC22.2), DACs/U_DAC_LTC2000 (IC1000_DACs_U_DAC_LTC2000#14.S2)
CS_2: DACs (IC22.10), DACs/U_DAC_LTC2000 (IC1000_DACs_U_DAC_LTC2000#15.S2)
CS_3: DACs (IC22.13), DACs/U_DAC_LTC2000 (IC1000_DACs_U_DAC_LTC2000#16.S2)
CS_4: DACs (IC23.1), DACs/U_DAC_LTC2000 (IC1000_DACs_U_DAC_LTC2000#17.S2)
CS_5: DACs (IC23.2), DACs/U_DAC_LTC2000 (IC1000_DACs_U_DAC_LTC2000#18.S2)
CS_6: DACs (IC23.10), DACs/U_DAC_LTC2000 (IC1000_DACs_U_DAC_LTC2000#7.S2)
CS_7: DACs (IC23.13), DACs/U_DAC_LTC2000 (IC1000_DACs_U_DAC_LTC2000#8.S2)
CS_8: DACs (IC24.1), DACs/U_DAC_LTC2000 (IC1000_DACs_U_DAC_LTC2000#9.S2)
CS_9: DACs (IC24.2), DACs/U_DAC_LTC2000 (IC1000_DACs_U_DAC_LTC2000#10.S2)
CS_10: DACs (IC24.10), DACs/U_DAC_LTC2000 (IC1000_DACs_U_DAC_LTC2000#11.S2)
CS_11: DACs (IC24.13), DACs/U_DAC_LTC2000 (IC1000_DACs_U_DAC_LTC2000#12.S2)
CS_12: DACs (IC25.1), DACs/U_DAC_LTC2000 (IC1000_DACs_U_DAC_LTC2000#1.S2)
CS_13: DACs (IC25.2), DACs/U_DAC_LTC2000 (IC1000_DACs_U_DAC_LTC2000#2.S2)
CS_14: DACs (IC25.10), DACs/U_DAC_LTC2000 (IC1000_DACs_U_DAC_LTC2000#3.S2)
CS_15: DACs (IC25.13), DACs/U_DAC_LTC2000 (IC1000_DACs_U_DAC_LTC2000#4.S2)
CS_16: DACs (IC26.1), DACs/U_DAC_LTC2000 (IC1000_DACs_U_DAC_LTC2000#5.S2)
CS_17: DACs (IC26.2), DACs/U_DAC_LTC2000 (IC1000_DACs_U_DAC_LTC2000#6.S2)
DAC_CLK_IN.CLK0_N: DACs/U_DAC_LTC2000 (C1001_DACs_U_DAC_LTC2000#13.1), Clock_Distribution_PLL (IC9.9)
DAC_CLK_IN.CLK0_P: DACs/U_DAC_LTC2000 (C1000_DACs_U_DAC_LTC2000#13.1), Clock_Distribution_PLL (IC9.10)
DAC_CLK_IN.CLK1_N: DACs/U_DAC_LTC2000 (C1001_DACs_U_DAC_LTC2000#14.1), Clock_Distribution_PLL (IC9.7)
DAC_CLK_IN.CLK1_P: DACs/U_DAC_LTC2000 (C1000_DACs_U_DAC_LTC2000#14.1), Clock_Distribution_PLL (IC9.8)
DAC_CLK_IN.CLK2_N: DACs/U_DAC_LTC2000 (C1001_DACs_U_DAC_LTC2000#15.1), Clock_Distribution_PLL (IC9.4)
DAC_CLK_IN.CLK2_P: DACs/U_DAC_LTC2000 (C1000_DACs_U_DAC_LTC2000#15.1), Clock_Distribution_PLL (IC9.5)
DAC_CLK_IN.CLK3_N: DACs/U_DAC_LTC2000 (C1001_DACs_U_DAC_LTC2000#16.1), Clock_Distribution_PLL (IC9.42)
DAC_CLK_IN.CLK3_P: DACs/U_DAC_LTC2000 (C1000_DACs_U_DAC_LTC2000#16.1), Clock_Distribution_PLL (IC9.43)
DAC_CLK_IN.CLK4_N: DACs/U_DAC_LTC2000 (C1001_DACs_U_DAC_LTC2000#17.1), Clock_Distribution_PLL (IC9.40)
DAC_CLK_IN.CLK4_P: DACs/U_DAC_LTC2000 (C1000_DACs_U_DAC_LTC2000#17.1), Clock_Distribution_PLL (IC9.41)
DAC_CLK_IN.CLK5_N: DACs/U_DAC_LTC2000 (C1001_DACs_U_DAC_LTC2000#18.1), Clock_Distribution_PLL (IC9.37)
DAC_CLK_IN.CLK5_P: DACs/U_DAC_LTC2000 (C1000_DACs_U_DAC_LTC2000#18.1), Clock_Distribution_PLL (IC9.38)
DAC_CLK_IN.CLK6_N: DACs/U_DAC_LTC2000 (C1001_DACs_U_DAC_LTC2000#7.1), Clock_Distribution_PLL (IC9.35)
DAC_CLK_IN.CLK6_P: DACs/U_DAC_LTC2000 (C1000_DACs_U_DAC_LTC2000#7.1), Clock_Distribution_PLL (IC9.36)
DAC_CLK_IN.CLK7_N: DACs/U_DAC_LTC2000 (C1001_DACs_U_DAC_LTC2000#8.1), Clock_Distribution_PLL (IC9.29)
DAC_CLK_IN.CLK7_P: DACs/U_DAC_LTC2000 (C1000_DACs_U_DAC_LTC2000#8.1), Clock_Distribution_PLL (IC9.30)
DAC_CLK_IN.CLK8_N: DACs/U_DAC_LTC2000 (C1001_DACs_U_DAC_LTC2000#9.1), Clock_Distribution_PLL (IC9.26)
DAC_CLK_IN.CLK8_P: DACs/U_DAC_LTC2000 (C1000_DACs_U_DAC_LTC2000#9.1), Clock_Distribution_PLL (IC9.27)
DAC_CLK_IN.CLK9_N: DACs/U_DAC_LTC2000 (C1001_DACs_U_DAC_LTC2000#10.1), Clock_Distribution_PLL (IC9.24)
DAC_CLK_IN.CLK9_P: DACs/U_DAC_LTC2000 (C1000_DACs_U_DAC_LTC2000#10.1), Clock_Distribution_PLL (IC9.25)
DAC_CLK_IN.CLK10_N: DACs/U_DAC_LTC2000 (C1001_DACs_U_DAC_LTC2000#11.1), Clock_Distribution_PLL (IC10.9)
DAC_CLK_IN.CLK10_P: DACs/U_DAC_LTC2000 (C1000_DACs_U_DAC_LTC2000#11.1), Clock_Distribution_PLL (IC10.10)
DAC_CLK_IN.CLK11_N: DACs/U_DAC_LTC2000 (C1001_DACs_U_DAC_LTC2000#12.1), Clock_Distribution_PLL (IC10.7)
DAC_CLK_IN.CLK11_P: DACs/U_DAC_LTC2000 (C1000_DACs_U_DAC_LTC2000#12.1), Clock_Distribution_PLL (IC10.8)
DAC_CLK_IN.CLK12_N: DACs/U_DAC_LTC2000 (C1001_DACs_U_DAC_LTC2000#1.1), Clock_Distribution_PLL (IC10.4)
DAC_CLK_IN.CLK12_P: DACs/U_DAC_LTC2000 (C1000_DACs_U_DAC_LTC2000#1.1), Clock_Distribution_PLL (IC10.5)
DAC_CLK_IN.CLK13_N: DACs/U_DAC_LTC2000 (C1001_DACs_U_DAC_LTC2000#2.1), Clock_Distribution_PLL (IC10.42)
DAC_CLK_IN.CLK13_P: DACs/U_DAC_LTC2000 (C1000_DACs_U_DAC_LTC2000#2.1), Clock_Distribution_PLL (IC10.43)
DAC_CLK_IN.CLK14_N: DACs/U_DAC_LTC2000 (C1001_DACs_U_DAC_LTC2000#3.1), Clock_Distribution_PLL (IC10.40)
DAC_CLK_IN.CLK14_P: DACs/U_DAC_LTC2000 (C1000_DACs_U_DAC_LTC2000#3.1), Clock_Distribution_PLL (IC10.41)
DAC_CLK_IN.CLK15_N: DACs/U_DAC_LTC2000 (C1001_DACs_U_DAC_LTC2000#4.1), Clock_Distribution_PLL (IC10.37)
DAC_CLK_IN.CLK15_P: DACs/U_DAC_LTC2000 (C1000_DACs_U_DAC_LTC2000#4.1), Clock_Distribution_PLL (IC10.38)
DAC_CLK_IN.CLK16_N: DACs/U_DAC_LTC2000 (C1001_DACs_U_DAC_LTC2000#5.1), Clock_Distribution_PLL (IC10.35)
DAC_CLK_IN.CLK16_P: DACs/U_DAC_LTC2000 (C1000_DACs_U_DAC_LTC2000#5.1), Clock_Distribution_PLL (IC10.36)
DAC_CLK_IN.CLK17_N: DACs/U_DAC_LTC2000 (C1001_DACs_U_DAC_LTC2000#6.1), Clock_Distribution_PLL (IC10.29)
DAC_CLK_IN.CLK17_P: DACs/U_DAC_LTC2000 (C1000_DACs_U_DAC_LTC2000#6.1), Clock_Distribution_PLL (IC10.30)
DAC_I2C.SCL: I2C_MUX (IC28.6 IC29.6 R131.2), DACs (6 pins)
DAC_I2C.SDA: I2C_MUX (IC28.5 IC29.5 R128.2), DACs (6 pins)
DAC_PD0: CPU_LPC1776 (IC11.L6), DACs/U_DAC_LTC2000 (IC1000_DACs_U_DAC_LTC2000#13.S1 R1018_DACs_U_DAC_LTC2000#13.2), DACs/U_DAC_LTC2000/Amplifier (T1001_DACs_U_DAC_LTC2000_Amplifier#13.1)
DAC_PD1: CPU_LPC1776 (IC11.M7), DACs/U_DAC_LTC2000 (IC1000_DACs_U_DAC_LTC2000#14.S1 R1018_DACs_U_DAC_LTC2000#14.2), DACs/U_DAC_LTC2000/Amplifier (T1001_DACs_U_DAC_LTC2000_Amplifier#14.1)
DAC_PD2: CPU_LPC1776 (IC11.M8), DACs/U_DAC_LTC2000 (IC1000_DACs_U_DAC_LTC2000#15.S1 R1018_DACs_U_DAC_LTC2000#15.2), DACs/U_DAC_LTC2000/Amplifier (T1001_DACs_U_DAC_LTC2000_Amplifier#15.1)
DAC_PD3: CPU_LPC1776 (IC11.K9), DACs/U_DAC_LTC2000 (IC1000_DACs_U_DAC_LTC2000#16.S1 R1018_DACs_U_DAC_LTC2000#16.2), DACs/U_DAC_LTC2000/Amplifier (T1001_DACs_U_DAC_LTC2000_Amplifier#16.1)
DAC_PD4: CPU_LPC1776 (IC11.P13), DACs/U_DAC_LTC2000 (IC1000_DACs_U_DAC_LTC2000#17.S1 R1018_DACs_U_DAC_LTC2000#17.2), DACs/U_DAC_LTC2000/Amplifier (T1001_DACs_U_DAC_LTC2000_Amplifier#17.1)
DAC_PD5: CPU_LPC1776 (IC11.H10), DACs/U_DAC_LTC2000 (IC1000_DACs_U_DAC_LTC2000#18.S1 R1018_DACs_U_DAC_LTC2000#18.2), DACs/U_DAC_LTC2000/Amplifier (T1001_DACs_U_DAC_LTC2000_Amplifier#18.1)
DAC_PD6: CPU_LPC1776 (IC11.K10), DACs/U_DAC_LTC2000 (IC1000_DACs_U_DAC_LTC2000#7.S1 R1018_DACs_U_DAC_LTC2000#7.2), DACs/U_DAC_LTC2000/Amplifier (T1001_DACs_U_DAC_LTC2000_Amplifier#7.1)
DAC_PD7: CPU_LPC1776 (IC11.K12), DACs/U_DAC_LTC2000 (IC1000_DACs_U_DAC_LTC2000#8.S1 R1018_DACs_U_DAC_LTC2000#8.2), DACs/U_DAC_LTC2000/Amplifier (T1001_DACs_U_DAC_LTC2000_Amplifier#8.1)
DAC_PD8: CPU_LPC1776 (IC11.E8), DACs/U_DAC_LTC2000 (IC1000_DACs_U_DAC_LTC2000#9.S1 R1018_DACs_U_DAC_LTC2000#9.2), DACs/U_DAC_LTC2000/Amplifier (T1001_DACs_U_DAC_LTC2000_Amplifier#9.1)
DAC_PD9: CPU_LPC1776 (IC11.C10), DACs/U_DAC_LTC2000 (IC1000_DACs_U_DAC_LTC2000#10.S1 R1018_DACs_U_DAC_LTC2000#10.2), DACs/U_DAC_LTC2000/Amplifier (T1001_DACs_U_DAC_LTC2000_Amplifier#10.1)
DAC_PD10: CPU_LPC1776 (IC11.N12), DACs/U_DAC_LTC2000 (IC1000_DACs_U_DAC_LTC2000#11.S1 R1018_DACs_U_DAC_LTC2000#11.2), DACs/U_DAC_LTC2000/Amplifier (T1001_DACs_U_DAC_LTC2000_Amplifier#11.1)
DAC_PD11: CPU_LPC1776 (IC11.N13), DACs/U_DAC_LTC2000 (IC1000_DACs_U_DAC_LTC2000#12.S1 R1018_DACs_U_DAC_LTC2000#12.2), DACs/U_DAC_LTC2000/Amplifier (T1001_DACs_U_DAC_LTC2000_Amplifier#12.1)
DAC_PD12: CPU_LPC1776 (IC11.P14), DACs/U_DAC_LTC2000 (IC1000_DACs_U_DAC_LTC2000#1.S1 R1018_DACs_U_DAC_LTC2000#1.2), DACs/U_DAC_LTC2000/Amplifier (T1001_DACs_U_DAC_LTC2000_Amplifier#1.1)
DAC_PD13: CPU_LPC1776 (IC11.M14), DACs/U_DAC_LTC2000 (IC1000_DACs_U_DAC_LTC2000#2.S1 R1018_DACs_U_DAC_LTC2000#2.2), DACs/U_DAC_LTC2000/Amplifier (T1001_DACs_U_DAC_LTC2000_Amplifier#2.1)
DAC_PD14: CPU_LPC1776 (IC11.C8), DACs/U_DAC_LTC2000 (IC1000_DACs_U_DAC_LTC2000#3.S1 R1018_DACs_U_DAC_LTC2000#3.2), DACs/U_DAC_LTC2000/Amplifier (T1001_DACs_U_DAC_LTC2000_Amplifier#3.1)
DAC_PD15: CPU_LPC1776 (IC11.D9), DACs/U_DAC_LTC2000 (IC1000_DACs_U_DAC_LTC2000#4.S1 R1018_DACs_U_DAC_LTC2000#4.2), DACs/U_DAC_LTC2000/Amplifier (T1001_DACs_U_DAC_LTC2000_Amplifier#4.1)
DAC_PD16: CPU_LPC1776 (IC11.K13), DACs/U_DAC_LTC2000 (IC1000_DACs_U_DAC_LTC2000#5.S1 R1018_DACs_U_DAC_LTC2000#5.2), DACs/U_DAC_LTC2000/Amplifier (T1001_DACs_U_DAC_LTC2000_Amplifier#5.1)
DAC_PD17: CPU_LPC1776 (IC11.F14), DACs/U_DAC_LTC2000 (IC1000_DACs_U_DAC_LTC2000#6.S1 R1018_DACs_U_DAC_LTC2000#6.2), DACs/U_DAC_LTC2000/Amplifier (T1001_DACs_U_DAC_LTC2000_Amplifier#6.1)
DDR3_64_A0: SDRAM_DDR3_4x16 (5 pins), FPGA_Banks_44_45_46_DDR64 (IC27.AE17)
DDR3_64_A1: SDRAM_DDR3_4x16 (5 pins), FPGA_Banks_44_45_46_DDR64 (IC27.AL17)
DDR3_64_A2: SDRAM_DDR3_4x16 (5 pins), FPGA_Banks_44_45_46_DDR64 (IC27.AG16)
DDR3_64_A3: SDRAM_DDR3_4x16 (5 pins), FPGA_Banks_44_45_46_DDR64 (IC27.AG17)
DDR3_64_A4: SDRAM_DDR3_4x16 (5 pins), FPGA_Banks_44_45_46_DDR64 (IC27.AD16)
DDR3_64_A5: SDRAM_DDR3_4x16 (5 pins), FPGA_Banks_44_45_46_DDR64 (IC27.AH14)
DDR3_64_A6: SDRAM_DDR3_4x16 (5 pins), FPGA_Banks_44_45_46_DDR64 (IC27.AD15)
DDR3_64_A7: SDRAM_DDR3_4x16 (5 pins), FPGA_Banks_44_45_46_DDR64 (IC27.AK15)
DDR3_64_A8: SDRAM_DDR3_4x16 (5 pins), FPGA_Banks_44_45_46_DDR64 (IC27.AF14)
DDR3_64_A9: SDRAM_DDR3_4x16 (5 pins), FPGA_Banks_44_45_46_DDR64 (IC27.AF15)
DDR3_64_A10: SDRAM_DDR3_4x16 (5 pins), FPGA_Banks_44_45_46_DDR64 (IC27.AL18)
DDR3_64_A11: SDRAM_DDR3_4x16 (5 pins), FPGA_Banks_44_45_46_DDR64 (IC27.AL15)
DDR3_64_A12: SDRAM_DDR3_4x16 (5 pins), FPGA_Banks_44_45_46_DDR64 (IC27.AE18)
DDR3_64_A13: SDRAM_DDR3_4x16 (5 pins), FPGA_Banks_44_45_46_DDR64 (IC27.AJ15)
DDR3_64_A14: SDRAM_DDR3_4x16 (5 pins), FPGA_Banks_44_45_46_DDR64 (IC27.AG14)
DDR3_64_BA0: SDRAM_DDR3_4x16 (5 pins), FPGA_Banks_44_45_46_DDR64 (IC27.AF17)
DDR3_64_BA1: SDRAM_DDR3_4x16 (5 pins), FPGA_Banks_44_45_46_DDR64 (IC27.AD19)
DDR3_64_BA2: SDRAM_DDR3_4x16 (5 pins), FPGA_Banks_44_45_46_DDR64 (IC27.AD18)
DDR3_64_DM0: SDRAM_DDR3_4x16 (IC46.E7), FPGA_Banks_44_45_46_DDR64 (IC27.AD21)
DDR3_64_DM1: SDRAM_DDR3_4x16 (IC46.D3), FPGA_Banks_44_45_46_DDR64 (IC27.AE25)
DDR3_64_DM2: SDRAM_DDR3_4x16 (IC47.E7), FPGA_Banks_44_45_46_DDR64 (IC27.AJ21)
DDR3_64_DM3: SDRAM_DDR3_4x16 (IC47.D3), FPGA_Banks_44_45_46_DDR64 (IC27.AM21)
DDR3_64_DM4: SDRAM_DDR3_4x16 (IC48.E7), FPGA_Banks_44_45_46_DDR64 (IC27.AH26)
DDR3_64_DM5: SDRAM_DDR3_4x16 (IC48.D3), FPGA_Banks_44_45_46_DDR64 (IC27.AN26)
DDR3_64_DM6: SDRAM_DDR3_4x16 (IC49.E7), FPGA_Banks_44_45_46_DDR64 (IC27.AJ29)
DDR3_64_DM7: SDRAM_DDR3_4x16 (IC49.D3), FPGA_Banks_44_45_46_DDR64 (IC27.AL32)
DDR3_64_DQ0: SDRAM_DDR3_4x16 (IC46.E3), FPGA_Banks_44_45_46_DDR64 (IC27.AE23)
DDR3_64_DQ1: SDRAM_DDR3_4x16 (IC46.F7), FPGA_Banks_44_45_46_DDR64 (IC27.AG20)
DDR3_64_DQ2: SDRAM_DDR3_4x16 (IC46.F2), FPGA_Banks_44_45_46_DDR64 (IC27.AF22)
DDR3_64_DQ3: SDRAM_DDR3_4x16 (IC46.F8), FPGA_Banks_44_45_46_DDR64 (IC27.AF20)
DDR3_64_DQ4: SDRAM_DDR3_4x16 (IC46.H3), FPGA_Banks_44_45_46_DDR64 (IC27.AE22)
DDR3_64_DQ5: SDRAM_DDR3_4x16 (IC46.H8), FPGA_Banks_44_45_46_DDR64 (IC27.AD20)
DDR3_64_DQ6: SDRAM_DDR3_4x16 (IC46.G2), FPGA_Banks_44_45_46_DDR64 (IC27.AG22)
DDR3_64_DQ7: SDRAM_DDR3_4x16 (IC46.H7), FPGA_Banks_44_45_46_DDR64 (IC27.AE20)
DDR3_64_DQ8: SDRAM_DDR3_4x16 (IC46.D7), FPGA_Banks_44_45_46_DDR64 (IC27.AJ24)
DDR3_64_DQ9: SDRAM_DDR3_4x16 (IC46.C3), FPGA_Banks_44_45_46_DDR64 (IC27.AG24)
DDR3_64_DQ10: SDRAM_DDR3_4x16 (IC46.C8), FPGA_Banks_44_45_46_DDR64 (IC27.AJ23)
DDR3_64_DQ11: SDRAM_DDR3_4x16 (IC46.C2), FPGA_Banks_44_45_46_DDR64 (IC27.AF23)
DDR3_64_DQ12: SDRAM_DDR3_4x16 (IC46.A7), FPGA_Banks_44_45_46_DDR64 (IC27.AH23)
DDR3_64_DQ13: SDRAM_DDR3_4x16 (IC46.A2), FPGA_Banks_44_45_46_DDR64 (IC27.AF24)
DDR3_64_DQ14: SDRAM_DDR3_4x16 (IC46.B8), FPGA_Banks_44_45_46_DDR64 (IC27.AH22)
DDR3_64_DQ15: SDRAM_DDR3_4x16 (IC46.A3), FPGA_Banks_44_45_46_DDR64 (IC27.AG25)
DDR3_64_DQ16: SDRAM_DDR3_4x16 (IC47.E3), FPGA_Banks_44_45_46_DDR64 (IC27.AL22)
DDR3_64_DQ17: SDRAM_DDR3_4x16 (IC47.F7), FPGA_Banks_44_45_46_DDR64 (IC27.AL25)
DDR3_64_DQ18: SDRAM_DDR3_4x16 (IC47.F2), FPGA_Banks_44_45_46_DDR64 (IC27.AM20)
DDR3_64_DQ19: SDRAM_DDR3_4x16 (IC47.F8), FPGA_Banks_44_45_46_DDR64 (IC27.AK23)
DDR3_64_DQ20: SDRAM_DDR3_4x16 (IC47.H3), FPGA_Banks_44_45_46_DDR64 (IC27.AK22)
DDR3_64_DQ21: SDRAM_DDR3_4x16 (IC47.H8), FPGA_Banks_44_45_46_DDR64 (IC27.AL24)
DDR3_64_DQ22: SDRAM_DDR3_4x16 (IC47.G2), FPGA_Banks_44_45_46_DDR64 (IC27.AL20)
DDR3_64_DQ23: SDRAM_DDR3_4x16 (IC47.H7), FPGA_Banks_44_45_46_DDR64 (IC27.AL23)
DDR3_64_DQ24: SDRAM_DDR3_4x16 (IC47.D7), FPGA_Banks_44_45_46_DDR64 (IC27.AM24)
DDR3_64_DQ25: SDRAM_DDR3_4x16 (IC47.C3), FPGA_Banks_44_45_46_DDR64 (IC27.AN23)
DDR3_64_DQ26: SDRAM_DDR3_4x16 (IC47.C8), FPGA_Banks_44_45_46_DDR64 (IC27.AN24)
DDR3_64_DQ27: SDRAM_DDR3_4x16 (IC47.C2), FPGA_Banks_44_45_46_DDR64 (IC27.AP23)
DDR3_64_DQ28: SDRAM_DDR3_4x16 (IC47.A7), FPGA_Banks_44_45_46_DDR64 (IC27.AP25)
DDR3_64_DQ29: SDRAM_DDR3_4x16 (IC47.A2), FPGA_Banks_44_45_46_DDR64 (IC27.AN22)
DDR3_64_DQ30: SDRAM_DDR3_4x16 (IC47.B8), FPGA_Banks_44_45_46_DDR64 (IC27.AP24)
DDR3_64_DQ31: SDRAM_DDR3_4x16 (IC47.A3), FPGA_Banks_44_45_46_DDR64 (IC27.AM22)
DDR3_64_DQ32: SDRAM_DDR3_4x16 (IC48.E3), FPGA_Banks_44_45_46_DDR64 (IC27.AH28)
DDR3_64_DQ33: SDRAM_DDR3_4x16 (IC48.F7), FPGA_Banks_44_45_46_DDR64 (IC27.AK26)
DDR3_64_DQ34: SDRAM_DDR3_4x16 (IC48.F2), FPGA_Banks_44_45_46_DDR64 (IC27.AK28)
DDR3_64_DQ35: SDRAM_DDR3_4x16 (IC48.F8), FPGA_Banks_44_45_46_DDR64 (IC27.AM27)
DDR3_64_DQ36: SDRAM_DDR3_4x16 (IC48.H3), FPGA_Banks_44_45_46_DDR64 (IC27.AJ28)
DDR3_64_DQ37: SDRAM_DDR3_4x16 (IC48.H8), FPGA_Banks_44_45_46_DDR64 (IC27.AH27)
DDR3_64_DQ38: SDRAM_DDR3_4x16 (IC48.G2), FPGA_Banks_44_45_46_DDR64 (IC27.AK27)
DDR3_64_DQ39: SDRAM_DDR3_4x16 (IC48.H7), FPGA_Banks_44_45_46_DDR64 (IC27.AM26)
DDR3_64_DQ40: SDRAM_DDR3_4x16 (IC48.D7), FPGA_Banks_44_45_46_DDR64 (IC27.AL30)
DDR3_64_DQ41: SDRAM_DDR3_4x16 (IC48.C3), FPGA_Banks_44_45_46_DDR64 (IC27.AP29)
DDR3_64_DQ42: SDRAM_DDR3_4x16 (IC48.C8), FPGA_Banks_44_45_46_DDR64 (IC27.AM30)
DDR3_64_DQ43: SDRAM_DDR3_4x16 (IC48.C2), FPGA_Banks_44_45_46_DDR64 (IC27.AN28)
DDR3_64_DQ44: SDRAM_DDR3_4x16 (IC48.A7), FPGA_Banks_44_45_46_DDR64 (IC27.AL29)
DDR3_64_DQ45: SDRAM_DDR3_4x16 (IC48.A2), FPGA_Banks_44_45_46_DDR64 (IC27.AP28)
DDR3_64_DQ46: SDRAM_DDR3_4x16 (IC48.B8), FPGA_Banks_44_45_46_DDR64 (IC27.AM29)
DDR3_64_DQ47: SDRAM_DDR3_4x16 (IC48.A3), FPGA_Banks_44_45_46_DDR64 (IC27.AN27)
DDR3_64_DQ48: SDRAM_DDR3_4x16 (IC49.E3), FPGA_Banks_44_45_46_DDR64 (IC27.AH31)
DDR3_64_DQ49: SDRAM_DDR3_4x16 (IC49.F7), FPGA_Banks_44_45_46_DDR64 (IC27.AH32)
DDR3_64_DQ50: SDRAM_DDR3_4x16 (IC49.F2), FPGA_Banks_44_45_46_DDR64 (IC27.AJ34)
DDR3_64_DQ51: SDRAM_DDR3_4x16 (IC49.F8), FPGA_Banks_44_45_46_DDR64 (IC27.AK31)
DDR3_64_DQ52: SDRAM_DDR3_4x16 (IC49.H3), FPGA_Banks_44_45_46_DDR64 (IC27.AJ31)
DDR3_64_DQ53: SDRAM_DDR3_4x16 (IC49.H8), FPGA_Banks_44_45_46_DDR64 (IC27.AJ30)
DDR3_64_DQ54: SDRAM_DDR3_4x16 (IC49.G2), FPGA_Banks_44_45_46_DDR64 (IC27.AH34)
DDR3_64_DQ55: SDRAM_DDR3_4x16 (IC49.H7), FPGA_Banks_44_45_46_DDR64 (IC27.AK32)
DDR3_64_DQ56: SDRAM_DDR3_4x16 (IC49.D7), FPGA_Banks_44_45_46_DDR64 (IC27.AN33)
DDR3_64_DQ57: SDRAM_DDR3_4x16 (IC49.C3), FPGA_Banks_44_45_46_DDR64 (IC27.AP33)
DDR3_64_DQ58: SDRAM_DDR3_4x16 (IC49.C8), FPGA_Banks_44_45_46_DDR64 (IC27.AM34)
DDR3_64_DQ59: SDRAM_DDR3_4x16 (IC49.C2), FPGA_Banks_44_45_46_DDR64 (IC27.AP31)
DDR3_64_DQ60: SDRAM_DDR3_4x16 (IC49.A7), FPGA_Banks_44_45_46_DDR64 (IC27.AM32)
DDR3_64_DQ61: SDRAM_DDR3_4x16 (IC49.A2), FPGA_Banks_44_45_46_DDR64 (IC27.AN31)
DDR3_64_DQ62: SDRAM_DDR3_4x16 (IC49.B8), FPGA_Banks_44_45_46_DDR64 (IC27.AL34)
DDR3_64_DQ63: SDRAM_DDR3_4x16 (IC49.A3), FPGA_Banks_44_45_46_DDR64 (IC27.AN32)
DDR64_CLK_N: Clk_recovery (C498.1), FPGA_Banks_44_45_46_DDR64 (IC27.AK16 R113.2 R114.2)
DDR64_CLK_P: Clk_recovery (C497.1), FPGA_Banks_44_45_46_DDR64 (IC27.AK17 R112.2 R114.1)
EN_1V0: QUAD_BUCK (IC33.C6), CPU_LPC1776 (IC11.B10)
EN_1V2: PWR_DC_DC_EXAR2 (IC13.11 MOD1.2 R81.2), CPU_LPC1776 (IC11.C6)
EN_1V5: QUAD_BUCK (IC33.F6), CPU_LPC1776 (IC11.D7)
EN_1V8: QUAD_BUCK (IC33.K7), CPU_LPC1776 (IC11.B6)
EN_3V3: QUAD_BUCK (IC33.J6), CPU_LPC1776 (IC11.C13)
EN_N3V5: PWR_P3V0_N3V0 (IC78.2 R463.1), CPU_LPC1776 (IC11.D8)
EN_P0V95: PWR_DC_DC_EXAR2 (IC72.11 MOD1.3 R84.2), CPU_LPC1776 (IC11.B13)
EN_P2V5: PWR_Buck_P2V5_8A (IC74.2 R447.1), CPU_LPC1776 (IC11.M9)
EN_P4V0: PWR_Buck_4V_20A (IC73.2 R434.1), CPU_LPC1776 (IC11.P8)
EN_P6V0: PWR_DC_DC_EXAR2 (R88.2), CPU_LPC1776 (IC11.N10)
EN_PSU_CH: PWR_DC_DC_EXAR2 (MOD1.6 R85.2), CPU_LPC1776 (IC11.K2)
EN_VCCINT: PWR_0V9_20A (IC39.2 R209.1), CPU_LPC1776 (IC11.P10)
ETH2_RGMII.MDIO_INTn: ETH_PHY_RMII (LD16.1 R364.2), FPGA_Banks_64_65_HR (IC27.K21)
ETH2_RGMII.PHY_RESETn: ETH_PHY_RMII (IC66.16 R361.1), FPGA_Banks_64_65_HR (IC27.K25)
ETH2_RGMII.RGMII2_MDC: ETH_PHY_RMII (IC66.7), FPGA_Banks_64_65_HR (IC27.T27)
ETH2_RGMII.RGMII2_MDIO: ETH_PHY_RMII (IC66.8 R353.1), FPGA_Banks_64_65_HR (IC27.R27)
ETH2_RGMII.RGMII2_RX_CLK: ETH_PHY_RMII (R356.2), FPGA_Banks_64_65_HR (IC27.P24)
ETH2_RGMII.RGMII2_RX_CTL: ETH_PHY_RMII (R355.2), FPGA_Banks_64_65_HR (IC27.T24)
ETH2_RGMII.RGMII2_TX_CLK: ETH_PHY_RMII (IC66.53), FPGA_Banks_64_65_HR (IC27.M22)
ETH2_RGMII.RGMII2_TX_CTL: ETH_PHY_RMII (IC66.56), FPGA_Banks_64_65_HR (IC27.N22)
FAT_PIPE1.Rx4_N: AMC_Connector (J1.48), FPGA_Banks_GTH (IC27.F1)
FAT_PIPE1.Rx4_P: AMC_Connector (J1.47), FPGA_Banks_GTH (IC27.F2)
FAT_PIPE1.Rx5_N: AMC_Connector (J1.54), FPGA_Banks_GTH (IC27.H1)
FAT_PIPE1.Rx5_P: AMC_Connector (J1.53), FPGA_Banks_GTH (IC27.H2)
FAT_PIPE1.Rx6_N: AMC_Connector (J1.63), FPGA_Banks_GTH (IC27.K1)
FAT_PIPE1.Rx6_P: AMC_Connector (J1.62), FPGA_Banks_GTH (IC27.K2)
FAT_PIPE1.Rx7_N: AMC_Connector (J1.69), FPGA_Banks_GTH (IC27.M1)
FAT_PIPE1.Rx7_P: AMC_Connector (J1.68), FPGA_Banks_GTH (IC27.M2)
FAT_PIPE1.Tx4_N: AMC_Connector (J1.45), FPGA_Banks_GTH (C631.2)
FAT_PIPE1.Tx4_P: AMC_Connector (J1.44), FPGA_Banks_GTH (C632.2)
FAT_PIPE1.Tx5_N: AMC_Connector (J1.51), FPGA_Banks_GTH (C626.2)
FAT_PIPE1.Tx5_P: AMC_Connector (J1.50), FPGA_Banks_GTH (C627.2)
FAT_PIPE1.Tx6_N: AMC_Connector (J1.60), FPGA_Banks_GTH (C619.2)
FAT_PIPE1.Tx6_P: AMC_Connector (J1.59), FPGA_Banks_GTH (C621.2)
FAT_PIPE1.Tx7_N: AMC_Connector (J1.66), FPGA_Banks_GTH (C615.2)
FAT_PIPE1.Tx7_P: AMC_Connector (J1.65), FPGA_Banks_GTH (C616.2)
FPGA_I2C.SCL: USB_SERIAL_QUAD (IC63.7 TP37.1), I2C_MUX (B2.1 IC28.19 R121.1), CPU_LPC1776 (R38.1), FPGA_Banks_64_65_HR (IC27.N21)
FPGA_I2C.SDA: USB_SERIAL_QUAD (IC63.6 TP36.1), I2C_MUX (B1.1 IC28.20 R120.1), CPU_LPC1776 (R37.1), FPGA_Banks_64_65_HR (IC27.M21)
FPGA_JTAG.TCK_PROG: JTAG_Configuration (R147.2 R157.1), FPGA_Bank_0_CFG (IC27.AC9)
FPGA_JTAG.TDI_PROG: JTAG_Configuration (R155.1), FPGA_Bank_0_CFG (IC27.V9)
FPGA_JTAG.TDO_PROG: JTAG_Configuration (R156.1), FPGA_Bank_0_CFG (IC27.U9)
FPGA_JTAG.TMS_PROG: JTAG_Configuration (R148.2 R158.1), FPGA_Bank_0_CFG (IC27.W9)
FPGA_RESETn: CPU_LPC1776 (IC11.H12 R44.2), FPGA_Banks_64_65_HR (IC27.H23)
FPGA_SPI_FLASH_UPD.EN_FLASH_UPDATE: CPU_LPC1776 (IC11.J4), FPGA_Bank_0_CFG (5 pins)
FPGA_SPI_FLASH_UPD.FLASH_UPD_CLK: CPU_LPC1776 (IC11.K6), FPGA_Bank_0_CFG (IC70.9)
FPGA_SPI_FLASH_UPD.FLASH_UPD_CSB: CPU_LPC1776 (IC11.N6), FPGA_Bank_0_CFG (IC70.2)
FPGA_SPI_FLASH_UPD.FLASH_UPD_MISO: CPU_LPC1776 (IC11.N7), FPGA_Bank_0_CFG (IC70.3)
FPGA_SPI_FLASH_UPD.FLASH_UPD_MOSI: CPU_LPC1776 (IC11.P7), FPGA_Bank_0_CFG (IC70.10)
FPGA_SPI_FLASH_UPD.FPGA_STATUS: CPU_LPC1776 (IC11.M5), FPGA_Banks_64_65_HR (IC27.K27)
FPGA_SPI_FLASH_UPD.MMC_FPGA_DONE: CPU_LPC1776 (IC11.B11), FPGA_Bank_0_CFG (R391.2)
FPGA_SPI_FLASH_UPD.MMC_FPGA_INIT_B: CPU_LPC1776 (IC11.J5), FPGA_Bank_0_CFG (R385.2)
FPGA_SPI_FLASH_UPD.MMC_FPGA_PROG_B: CPU_LPC1776 (IC11.A11), FPGA_Bank_0_CFG (R388.2)
FPGA_SPI_FLASH_UPD.MMC_MISO1: CPU_LPC1776 (IC11.C12), FPGA_Banks_64_65_HR (IC27.H26)
FPGA_SPI_FLASH_UPD.MMC_MOSI1: CPU_LPC1776 (IC11.A13), FPGA_Banks_64_65_HR (IC27.J24)
FPGA_SPI_FLASH_UPD.MMC_SCK1: CPU_LPC1776 (IC11.B12), FPGA_Banks_64_65_HR (IC27.H24)
FPGA_SPI_FLASH_UPD.MMC_SSEL1: CPU_LPC1776 (IC11.D11), FPGA_Banks_64_65_HR (IC27.J26)
FPGA_THERM.DXN: Thermometers (R327.1), FPGA_Bank_0_CFG (IC27.Y11)
FPGA_THERM.DXP: Thermometers (C533.2 C534.2 IC57.3), FPGA_Bank_0_CFG (IC27.Y12)
Helper_DCXO_N: Clk_recovery (C698.2 R401.2), DDMTD (C732.1), FPGA_Banks_64_65_HR (IC27.N26 R406.2)
Helper_DCXO_OE: Clk_recovery (R396.1 R402.1), FPGA_Banks_64_65_HR (IC27.L22)
Helper_DCXO_P: Clk_recovery (C697.2 R389.2 R392.2), DDMTD (C731.1), FPGA_Banks_64_65_HR (IC27.P26 R405.2)
Helper_DCXO_SCL: Clk_recovery (OSC2.8 R394.1 TP41.1), FPGA_Banks_64_65_HR (IC27.L25)
Helper_DCXO_SDA: Clk_recovery (OSC2.7 R395.1 TP40.1), FPGA_Banks_64_65_HR (IC27.K23)
HMC_MISO: Clock_Distribution_PLL (IC8.33), FPGA_Banks_64_65_HR (IC27.L27)
HMC_MOSI: Clock_Distribution_PLL (IC8.31), FPGA_Banks_64_65_HR (IC27.J23)
HMC_SCK1: Clock_Distribution_PLL (IC8.32 R25.1), FPGA_Banks_64_65_HR (IC27.L24)
HMC_SSEL: Clock_Distribution_PLL (IC8.30 R26.1), FPGA_Banks_64_65_HR (IC27.M27)
I2C_MUX_ADDR1: I2C_MUX (R129.1 R145.1), CPU_LPC1776 (IC11.L1)
I2C_MUX_ADDR2: I2C_MUX (R127.1 R144.1), CPU_LPC1776 (IC11.M2)
I2C_SW_RESETn: I2C_MUX (IC29.24), CPU_LPC1776 (IC11.E5 R46.2)
IO_RX_P17: M-LVDS_PHY (IC51.1), FPGA_Banks_44_45_46_DDR64 (IC27.AP15)
IO_RX_P18: M-LVDS_PHY (IC51.4), FPGA_Banks_44_45_46_DDR64 (IC27.AM16)
IO_RX_P19: M-LVDS_PHY (IC51.6), FPGA_Banks_44_45_46_DDR64 (IC27.AM15)
IO_RX_P20: M-LVDS_PHY (IC51.8), FPGA_Banks_44_45_46_DDR64 (IC27.AN18)
IO_TX_P17: M-LVDS_PHY (IC35.1), FPGA_Banks_44_45_46_DDR64 (IC27.AM19)
IO_TX_P18: M-LVDS_PHY (IC35.4), FPGA_Banks_44_45_46_DDR64 (IC27.AL14)
IO_TX_P19: M-LVDS_PHY (IC35.6), FPGA_Banks_44_45_46_DDR64 (IC27.AM14)
IO_TX_P20: M-LVDS_PHY (IC35.8), FPGA_Banks_44_45_46_DDR64 (IC27.AP16)
IOUT_N_U_DAC_LTC2000: DACs/U_DAC_LTC2000 (IC1000_DACs_U_DAC_LTC2000#1.J1), DACs/U_DAC_LTC2000/Amplifier (R1023_DACs_U_DAC_LTC2000_Amplifier#1.1 R1025_DACs_U_DAC_LTC2000_Amplifier#1.2)
IOUT_N_U_DAC_LTC2000: DACs/U_DAC_LTC2000 (IC1000_DACs_U_DAC_LTC2000#2.J1), DACs/U_DAC_LTC2000/Amplifier (R1023_DACs_U_DAC_LTC2000_Amplifier#2.1 R1025_DACs_U_DAC_LTC2000_Amplifier#2.2)
IOUT_N_U_DAC_LTC2000: DACs/U_DAC_LTC2000 (IC1000_DACs_U_DAC_LTC2000#3.J1), DACs/U_DAC_LTC2000/Amplifier (R1023_DACs_U_DAC_LTC2000_Amplifier#3.1 R1025_DACs_U_DAC_LTC2000_Amplifier#3.2)
IOUT_N_U_DAC_LTC2000: DACs/U_DAC_LTC2000 (IC1000_DACs_U_DAC_LTC2000#4.J1), DACs/U_DAC_LTC2000/Amplifier (R1023_DACs_U_DAC_LTC2000_Amplifier#4.1 R1025_DACs_U_DAC_LTC2000_Amplifier#4.2)
IOUT_N_U_DAC_LTC2000: DACs/U_DAC_LTC2000 (IC1000_DACs_U_DAC_LTC2000#5.J1), DACs/U_DAC_LTC2000/Amplifier (R1023_DACs_U_DAC_LTC2000_Amplifier#5.1 R1025_DACs_U_DAC_LTC2000_Amplifier#5.2)
IOUT_N_U_DAC_LTC2000: DACs/U_DAC_LTC2000 (IC1000_DACs_U_DAC_LTC2000#6.J1), DACs/U_DAC_LTC2000/Amplifier (R1023_DACs_U_DAC_LTC2000_Amplifier#6.1 R1025_DACs_U_DAC_LTC2000_Amplifier#6.2)
IOUT_N_U_DAC_LTC2000: DACs/U_DAC_LTC2000 (IC1000_DACs_U_DAC_LTC2000#7.J1), DACs/U_DAC_LTC2000/Amplifier (R1023_DACs_U_DAC_LTC2000_Amplifier#7.1 R1025_DACs_U_DAC_LTC2000_Amplifier#7.2)
IOUT_N_U_DAC_LTC2000: DACs/U_DAC_LTC2000 (IC1000_DACs_U_DAC_LTC2000#8.J1), DACs/U_DAC_LTC2000/Amplifier (R1023_DACs_U_DAC_LTC2000_Amplifier#8.1 R1025_DACs_U_DAC_LTC2000_Amplifier#8.2)
IOUT_N_U_DAC_LTC2000: DACs/U_DAC_LTC2000 (IC1000_DACs_U_DAC_LTC2000#9.J1), DACs/U_DAC_LTC2000/Amplifier (R1023_DACs_U_DAC_LTC2000_Amplifier#9.1 R1025_DACs_U_DAC_LTC2000_Amplifier#9.2)
IOUT_N_U_DAC_LTC2000: DACs/U_DAC_LTC2000 (IC1000_DACs_U_DAC_LTC2000#10.J1), DACs/U_DAC_LTC2000/Amplifier (R1023_DACs_U_DAC_LTC2000_Amplifier#10.1 R1025_DACs_U_DAC_LTC2000_Amplifier#10.2)
IOUT_N_U_DAC_LTC2000: DACs/U_DAC_LTC2000 (IC1000_DACs_U_DAC_LTC2000#11.J1), DACs/U_DAC_LTC2000/Amplifier (R1023_DACs_U_DAC_LTC2000_Amplifier#11.1 R1025_DACs_U_DAC_LTC2000_Amplifier#11.2)
IOUT_N_U_DAC_LTC2000: DACs/U_DAC_LTC2000 (IC1000_DACs_U_DAC_LTC2000#12.J1), DACs/U_DAC_LTC2000/Amplifier (R1023_DACs_U_DAC_LTC2000_Amplifier#12.1 R1025_DACs_U_DAC_LTC2000_Amplifier#12.2)
IOUT_N_U_DAC_LTC2000: DACs/U_DAC_LTC2000 (IC1000_DACs_U_DAC_LTC2000#13.J1), DACs/U_DAC_LTC2000/Amplifier (R1023_DACs_U_DAC_LTC2000_Amplifier#13.1 R1025_DACs_U_DAC_LTC2000_Amplifier#13.2)
IOUT_N_U_DAC_LTC2000: DACs/U_DAC_LTC2000 (IC1000_DACs_U_DAC_LTC2000#14.J1), DACs/U_DAC_LTC2000/Amplifier (R1023_DACs_U_DAC_LTC2000_Amplifier#14.1 R1025_DACs_U_DAC_LTC2000_Amplifier#14.2)
IOUT_N_U_DAC_LTC2000: DACs/U_DAC_LTC2000 (IC1000_DACs_U_DAC_LTC2000#15.J1), DACs/U_DAC_LTC2000/Amplifier (R1023_DACs_U_DAC_LTC2000_Amplifier#15.1 R1025_DACs_U_DAC_LTC2000_Amplifier#15.2)
IOUT_N_U_DAC_LTC2000: DACs/U_DAC_LTC2000 (IC1000_DACs_U_DAC_LTC2000#16.J1), DACs/U_DAC_LTC2000/Amplifier (R1023_DACs_U_DAC_LTC2000_Amplifier#16.1 R1025_DACs_U_DAC_LTC2000_Amplifier#16.2)
IOUT_N_U_DAC_LTC2000: DACs/U_DAC_LTC2000 (IC1000_DACs_U_DAC_LTC2000#17.J1), DACs/U_DAC_LTC2000/Amplifier (R1023_DACs_U_DAC_LTC2000_Amplifier#17.1 R1025_DACs_U_DAC_LTC2000_Amplifier#17.2)
IOUT_N_U_DAC_LTC2000: DACs/U_DAC_LTC2000 (IC1000_DACs_U_DAC_LTC2000#18.J1), DACs/U_DAC_LTC2000/Amplifier (R1023_DACs_U_DAC_LTC2000_Amplifier#18.1 R1025_DACs_U_DAC_LTC2000_Amplifier#18.2)
IOUT_P_U_DAC_LTC2000: DACs/U_DAC_LTC2000 (IC1000_DACs_U_DAC_LTC2000#1.H1), DACs/U_DAC_LTC2000/Amplifier (R1020_DACs_U_DAC_LTC2000_Amplifier#1.1 R1022_DACs_U_DAC_LTC2000_Amplifier#1.2)
IOUT_P_U_DAC_LTC2000: DACs/U_DAC_LTC2000 (IC1000_DACs_U_DAC_LTC2000#2.H1), DACs/U_DAC_LTC2000/Amplifier (R1020_DACs_U_DAC_LTC2000_Amplifier#2.1 R1022_DACs_U_DAC_LTC2000_Amplifier#2.2)
IOUT_P_U_DAC_LTC2000: DACs/U_DAC_LTC2000 (IC1000_DACs_U_DAC_LTC2000#3.H1), DACs/U_DAC_LTC2000/Amplifier (R1020_DACs_U_DAC_LTC2000_Amplifier#3.1 R1022_DACs_U_DAC_LTC2000_Amplifier#3.2)
IOUT_P_U_DAC_LTC2000: DACs/U_DAC_LTC2000 (IC1000_DACs_U_DAC_LTC2000#4.H1), DACs/U_DAC_LTC2000/Amplifier (R1020_DACs_U_DAC_LTC2000_Amplifier#4.1 R1022_DACs_U_DAC_LTC2000_Amplifier#4.2)
IOUT_P_U_DAC_LTC2000: DACs/U_DAC_LTC2000 (IC1000_DACs_U_DAC_LTC2000#5.H1), DACs/U_DAC_LTC2000/Amplifier (R1020_DACs_U_DAC_LTC2000_Amplifier#5.1 R1022_DACs_U_DAC_LTC2000_Amplifier#5.2)